# Altium project bms_R00.PrjPCB
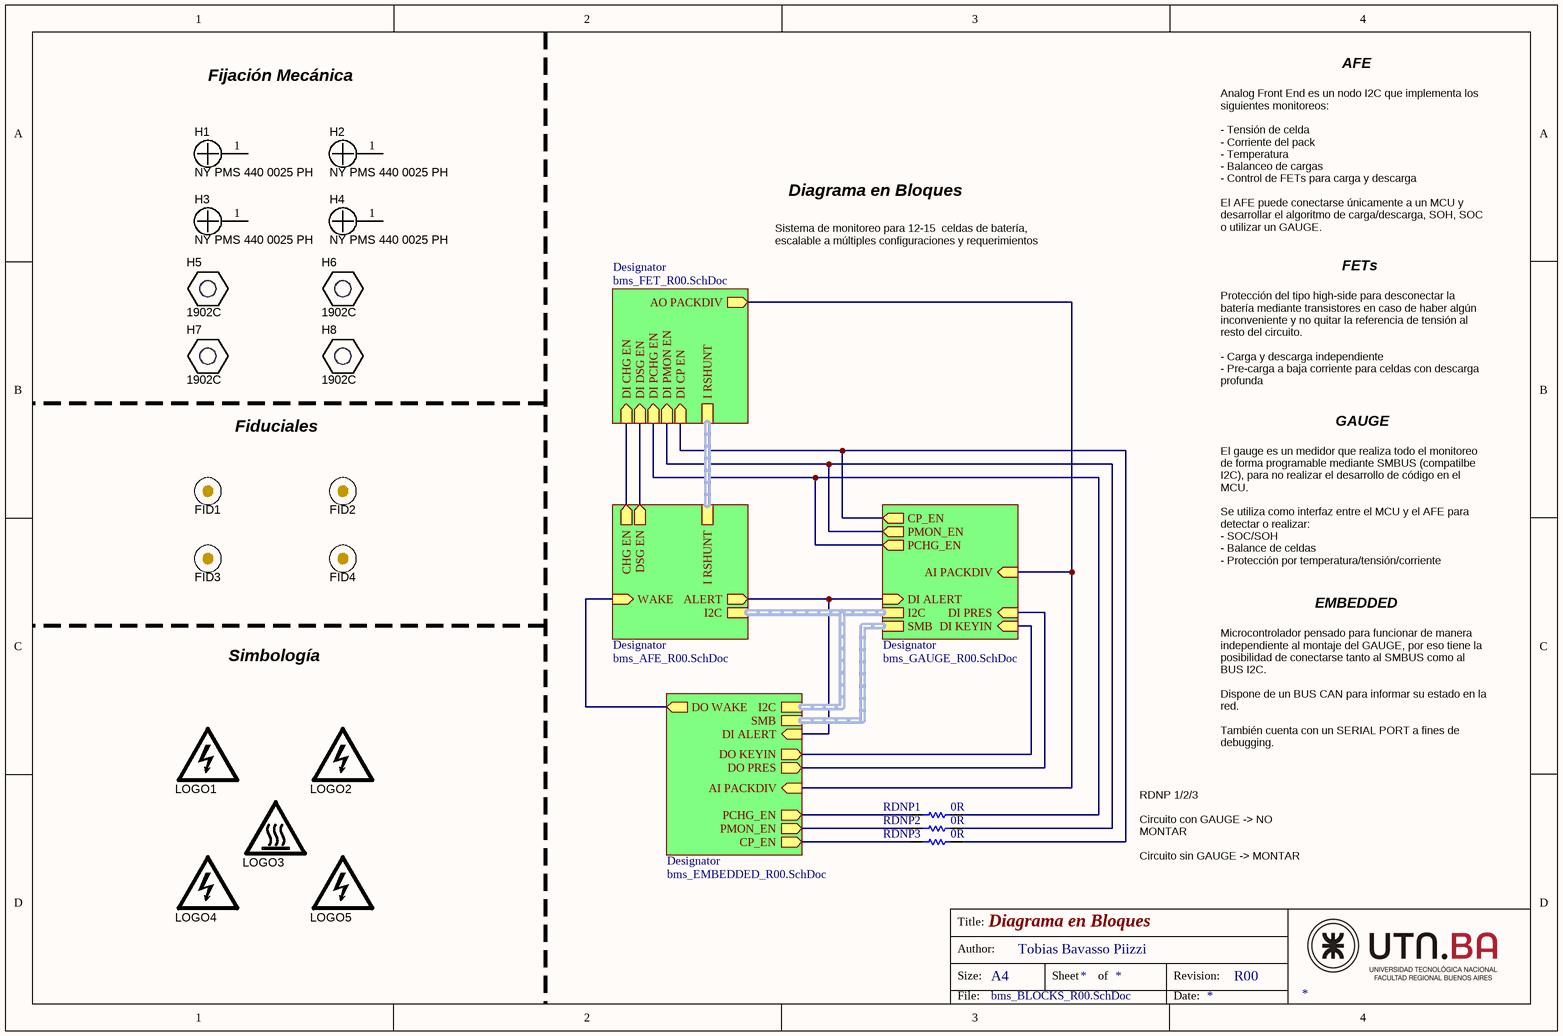
[diagram p0: bms_BLOCKS_R00.SchDoc]
5 sheets, 311 parts. Net scope: hierarchical (ports join the sheet entries above them; power ports are global).
Board files: bms_R00.PcbDoc, bmsPanel_R00.PcbDoc
Sheets:
  bms_BLOCKS_R00.SchDoc
    Designator = bms_FET_R00.SchDoc
    Designator = bms_AFE_R00.SchDoc
    Designator = bms_GAUGE_R00.SchDoc
    Designator = bms_EMBEDDED_R00.SchDoc

## Sheet bms_BLOCKS_R00.SchDoc: Diagrama en Bloques
size A4; Author: Tobias Bavasso Piizzi; Revision: R00

### Parts
FID1  Fiducial  [Fiducial10-20]  (value not drawn)
FID2  Fiducial  [Fiducial10-20]  (value not drawn)
FID3  Fiducial  [Fiducial10-20]  (value not drawn)
FID4  Fiducial  [Fiducial10-20]  (value not drawn)
H1  NY PMS 440 0025 PH  [NY PMS 440 0025 PH]
H2  NY PMS 440 0025 PH  [NY PMS 440 0025 PH]
H3  NY PMS 440 0025 PH  [NY PMS 440 0025 PH]
H4  NY PMS 440 0025 PH  [NY PMS 440 0025 PH]
H5  1902C  [Keystone_1902C]
H6  1902C  [Keystone_1902C]
H7  1902C  [Keystone_1902C]
H8  1902C  [Keystone_1902C]
LOGO1  DANGER HIGH VOLTAGE  [IEC_HighVoltage_Small]  (value not drawn)  (no BOM)
LOGO2  DANGER HIGH VOLTAGE  [IEC_HighVoltage_Small]  (value not drawn)  (no BOM)
LOGO3  CAUTION HOT SURFACE  [IEC_HotSurface_Small]  (value not drawn)  (no BOM)
LOGO4  DANGER HIGH VOLTAGE  [IEC_HighVoltage_Small]  (value not drawn)  (no BOM)
LOGO5  DANGER HIGH VOLTAGE  [IEC_HighVoltage_Small]  (value not drawn)  (no BOM)
RDNP1  0R  [R0603]
RDNP2  0R  [R0603]
RDNP3  0R  [R0603]

### Sub-sheets
Designator = bms_FET_R00.SchDoc: DI CHG EN (in), DI PMON EN (in), DI PCHG EN (in), I RSHUNT (harness I Sense), DI DSG EN (in), DI CP EN (in), AO PACKDIV (out)
Designator = bms_AFE_R00.SchDoc: I2C (harness I2C), CHG EN (out), DSG EN (out), ALERT (out), I RSHUNT (harness I Sense), WAKE (in)
Designator = bms_GAUGE_R00.SchDoc: PMON_EN (out), PCHG_EN (out), CP_EN (out), AI PACKDIV (in), DI ALERT (in), DI KEYIN (in), DI PRES (in), SMB (harness SMBus), I2C (harness I2C)
Designator = bms_EMBEDDED_R00.SchDoc: AI PACKDIV (in), DI ALERT (in), DO WAKE (out), PCHG_EN (out), I2C (harness I2C), SMB (harness SMBus), CP_EN (out), PMON_EN (out), DO PRES (out), DO KEYIN (out)

### Nets
~{KEY}: sheet Designator/DI KEYIN, sheet Designator/DO KEYIN
~{PRES}S: sheet Designator/DI PRES, sheet Designator/DO PRES
ALERT: sheet Designator/ALERT, sheet Designator/DI ALERT, sheet Designator/DI ALERT
CHG_EN: sheet Designator/DI CHG EN, sheet Designator/CHG EN
CP_EN: RDNP3.2 ; sheet Designator/DI CP EN, sheet Designator/CP_EN
DSG_EN: sheet Designator/DI DSG EN, sheet Designator/DSG EN
PACKDIV: sheet Designator/AO PACKDIV, sheet Designator/AI PACKDIV, sheet Designator/AI PACKDIV
PCHG_EN: RDNP1.2 ; sheet Designator/DI PCHG EN, sheet Designator/PCHG_EN
PMON_EN: RDNP2.2 ; sheet Designator/DI PMON EN, sheet Designator/PMON_EN
PTB4: RDNP3.1 ; sheet Designator/CP_EN
PTB5: RDNP2.1 ; sheet Designator/PMON_EN
PTC9: sheet Designator/WAKE, sheet Designator/DO WAKE
PTE8: RDNP1.1 ; sheet Designator/PCHG_EN

Not connected (* = marked no-connect by the designer): H1 1; H2 1; H3 1; H4 1

### Notes on the sheet
- Fijación Mecánica
- AFE
- Diagrama en Bloques
- Analog Front End es un nodo I2C que implementa los siguientes monitoreos:
  - Tensión de celda
  - Corriente del pack
  - Temperatura
  - Balanceo de cargas
  - Control de FETs para carga y descarga
  El AFE puede conectarse únicamente a un MCU y desarrollar el algoritmo de carga/descarga, SOH, SOC o utilizar un GAUGE.
- Sistema de monitoreo para 12-15  celdas de batería, escalable a múltiples configuraciones y requerimientos
- FETs
- Fiduciales
- Protección del tipo high-side para desconectar la batería mediante transistores en caso de haber algún inconveniente y no quitar la referencia de tensión al resto del circuito.
  - Carga y descarga independiente
  - Pre-carga a baja corriente para celdas con descarga profunda
- GAUGE
- El gauge es un medidor que realiza todo el monitoreo de forma programable mediante SMBUS (compatilbe I2C), para no realizar el desarrollo de código en el MCU.
  Se utiliza como interfaz entre el MCU y el AFE para detectar o realizar:
  - SOC/SOH
  - Balance de celdas
  - Protección por temperatura/tensión/corriente
- EMBEDDED
- Simbología
- Microcontrolador pensado para funcionar de manera independiente al montaje del GAUGE, por eso tiene la posibilidad de conectarse tanto al SMBUS como al BUS I2C.
  Dispone de un BUS CAN para informar su estado en la red.
  También cuenta con un SERIAL PORT a fines de debugging.
- RDNP 1/2/3
  Circuito con GAUGE -> NO MONTAR
  Circuito sin GAUGE -> MONTAR
- Title:
- Size:
- Author:
- A4
- Sheet
- of
- Revision:
- File:
- Date:

### Library data of the parts
FID1-FID4 = Fiducial_1: Fiducial mark.  There is nothing to buy or mount.; SymbolCreator: codlsc; SymbolVersion: 2009-11-4; CompType: Fiducial; Publisher: Texas Instruments; LatestRevisionDate: 2014-08-01; LatestRevisionNote: Added Alternate PartNumber and Alternate Manufacturer parameters to appropriate components.; Manufacturer: N/A; MountType: N/A; PackageReference: Fiducial; PartNumber: N/A; ClassName: FiducialMark
H1-H4 = NY PMS 440 0025 PH: Machine Screw, Round, #4-40 x 1/4, Nylon, Philips panhead; Manufacturer: B&F Fastener Supply; CompType: Hardware; SymbolCreator: codlsc; U/M: EA; SymbolVersion: 2009-10-28; MountType: N/A; RoHS: Y; PartNumber: NY PMS 440 0025 PH; PackageReference: Screw; DigiKeyPartNumber: H542-ND; ComponentLink1Description: Datasheet Link; ComponentLink1URL: http://www.fasnetdirect.com/refguide/Nylpanms.pdf; ClassName: Mounting Holes; LatestRevisionDate: 2015-07-23; Publisher: Texas Instruments; Supplier 1: Digi-Key; Supplier Part Number 1: H542-ND
H5-H8 = 1902C: Standoff, Hex, 0.5"L #4-40 Nylon; Manufacturer: Keystone; CompType: Hardware; MountType: N/A; RoHS: Y; PartNumber: 1902C; PackageReference: Standoff; ComponentLink1Description: Datasheet Link; ComponentLink1URL: http://www.keyelco.com/pdfs/M55-prod31.pdf; Alternate Manufacturer: -; Alternate PartNumber: -; LatestRevisionDate: 2012-06-27; LatestRevisionNote: Initial Version; Publisher: Texas Instruments; Supplier 1: Digi-Key; Supplier Part Number 1: 1902CK-ND
LOGO1 LOGO2 LOGO4 LOGO5 = IEC_HighVoltage: IEC 61010-1 High Voltage Warning; SymbolCreator: a0412235; SymbolVersion: 2011-08-22; Published: 2009-03-03; Publisher: Texas Instruments; LatestRevisionDate: 2016-03-21
LOGO3 = IEC_HotSurface: IEC 61010-1 Hot Surface Warning; SymbolCreator: a0412235; SymbolVersion: 2011-08-22; Published: 2009-03-03; Publisher: Texas Instruments; LatestRevisionDate: 2016-03-21
RDNP1-RDNP3 = Res: Resistor

## Sheet bms_FET_R00.SchDoc: **
size A4; Author: **; CompanyName: Introducción al Diseño de Circuitos Impresos; Organization: UTN FRBA; Revision: **
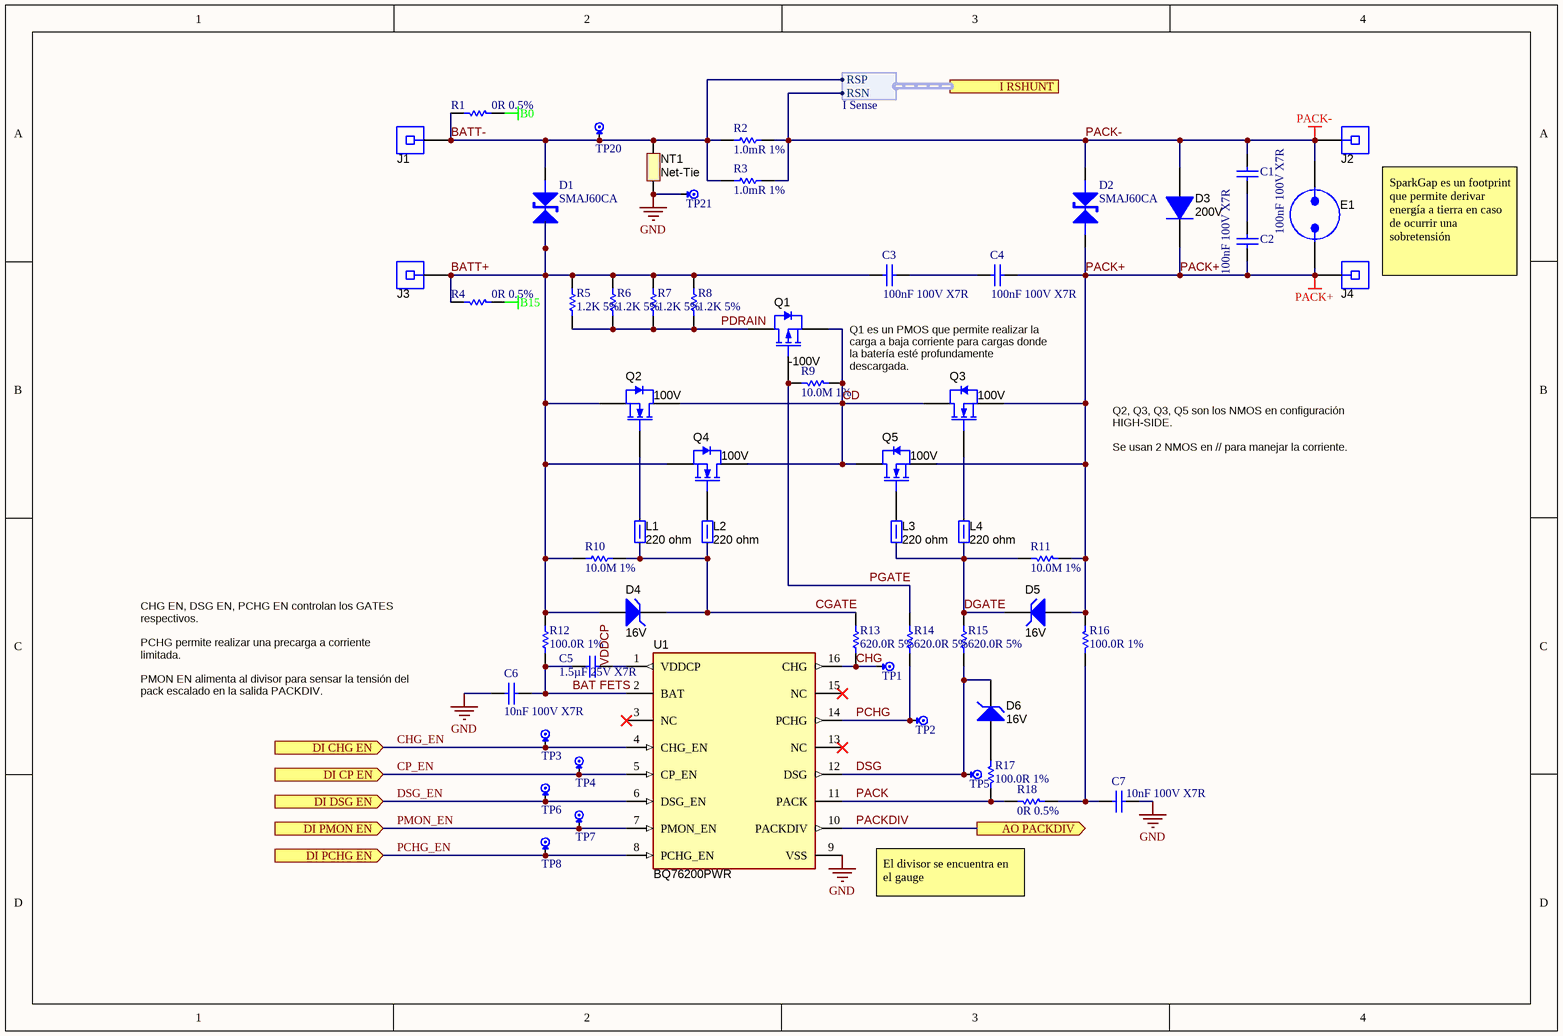
[diagram p1: bms_FET_R00.SchDoc]

### Parts
C1  100nF 100V X7R  [C0603]
C2  100nF 100V X7R  [C0603]
C3  100nF 100V X7R  [C0603]
C4  100nF 100V X7R  [C0603]
C5  1.5µF 25V X7R  [0805_HV_2]
C6  10nF 100V X7R  [0805_HV_2]
C7  10nF 100V X7R  [0805_HV_2]
D1  SMAJ60CA  [DO-214AB(SMA)]
D2  SMAJ60CA  [DO-214AB(SMA)]
D3  value 200V  [SMC]  (hidden comment: ES3D-E3/57T)
D4  value 16V  [sod-323]  (hidden comment: MMSZ5246BS-7-F)
D5  value 16V  [sod-323]  (hidden comment: MMSZ5246BS-7-F)
D6  value 16V  [sod-323]  (hidden comment: MMSZ5246BS-7-F)
E1  N/A  [SPARK_GAP2]  (value not drawn)
J1  L35  [TB_L35]  (value not drawn)
J2  L35  [TB_L35]  (value not drawn)
J3  L35  [TB_L35]  (value not drawn)
J4  L35  [TB_L35]  (value not drawn)
L1  value 220 ohm  [0603 FB]  (hidden comment: BLM18SG221TN1D)
L2  value 220 ohm  [0603 FB]  (hidden comment: BLM18SG221TN1D)
L3  value 220 ohm  [0603 FB]  (hidden comment: BLM18SG221TN1D)
L4  value 220 ohm  [0603 FB]  (hidden comment: BLM18SG221TN1D)
NT1  Net-Tie  [Net-Tie_50milWide_30milLong]  (net tie, no BOM)
Q1  value -100V  [SOT-23]  (hidden comment: ZXMP10A13FTA)
Q2  value 100V  [KTT0002A_N]  (hidden comment: CSD19536KTT)
Q3  value 100V  [KTT0002A_N]  (hidden comment: CSD19536KTT)
Q4  value 100V  [KTT0002A_N]  (hidden comment: CSD19536KTT)
Q5  value 100V  [KTT0002A_N]  (hidden comment: CSD19536KTT)
R1  0R 0.5%  [R0603]
R2  1.0mR 1%  [2010]
R3  1.0mR 1%  [2010]
R4  0R 0.5%  [R0603]
R5  1.2K 5%  [2512]
R6  1.2K 5%  [2512]
R7  1.2K 5%  [2512]
R8  1.2K 5%  [2512]
R9  10.0M 1%  [R0603]
R10  10.0M 1%  [R0603]
R11  10.0M 1%  [R0603]
R12  100.0R 1%  [R0603]
R13  620.0R 5%  [R0603]
R14  620.0R 5%  [R0603]
R15  620.0R 5%  [R0603]
R16  100.0R 1%  [R0603]
R17  100.0R 1%  [R0603]
R18  0R 0.5%  [R0603]
TP1  Test Point  [TEST POINT SMD 1]  (value not drawn)
TP2  Test Point  [TEST POINT SMD 1]  (value not drawn)
TP3  Test Point  [TEST POINT SMD 1]  (value not drawn)
TP4  Test Point  [TEST POINT SMD 1]  (value not drawn)
TP5  Test Point  [TEST POINT SMD 1]  (value not drawn)
TP6  Test Point  [TEST POINT SMD 1]  (value not drawn)
TP7  Test Point  [TEST POINT SMD 1]  (value not drawn)
TP8  Test Point  [TEST POINT SMD 1]  (value not drawn)
TP20  Test Point  [TEST POINT SMD 1]  (value not drawn)
TP21  Test Point  [TEST POINT SMD 1]  (value not drawn)
U1  BQ76200PWR  [PW0016A_N]

### Ports
AO PACKDIV (out), DI CHG EN (in), DI CP EN (in), DI DSG EN (in), DI PCHG EN (in), DI PMON EN (in), I RSHUNT (harness I Sense)

### Harnesses
I Sense: RSP, RSN

### Nets
B0: R1.2
B15: R4.2
GND: C6.1 C7.2 NT1.1 TP21.1 U1.9(VSS)
PACK+: C2.1 C4.2 D2.K D3.1(K) D5.2(A) E1.1 J4.1 Q3.3(S) Q5.3(S) R11.2 R16.2
PACK-: C1.2 D2.A D3.2(A) E1.2 J2.1 R2.2 R3.2 ; port I RSHUNT.RSN
BAT FETS: C5.1 C6.2 R12.1 U1.2(BAT)
BATT+: C3.1 D1.K D4.2(A) J3.1 Q2.3(S) Q4.3(S) R4.1 R5.2 R6.2 R7.2 R8.2 R10.2 R12.2
BATT-: D1.A J1.1 NT1.2 R1.1 R2.1 R3.1 TP20.1 ; port I RSHUNT.RSP
CD: Q1.2(S) Q2.2(D) Q3.2(D) Q4.2(D) Q5.2(D) R9.2
CGATE: D4.1(K) L1.1 L2.1 R10.1 R13.1
CHG: R13.2 TP1.1 U1.16(CHG)
CHG_EN: TP3.1 U1.4(CHG_EN) ; port DI CHG EN
CP_EN: TP4.1 U1.5(CP_EN) ; port DI CP EN
DGATE: D5.1(K) L3.1 L4.1 R11.1 R15.1
DSG: D6.1(K) R15.2 TP5.1 U1.12(DSG)
DSG_EN: TP6.1 U1.6(DSG_EN) ; port DI DSG EN
PACK: R17.1 R18.2 U1.11(PACK)
PACKDIV: U1.10(PACKDIV) ; port AO PACKDIV
PCHG: R14.2 TP2.1 U1.14(PCHG)
PCHG_EN: TP8.1 U1.8(PCHG_EN) ; port DI PCHG EN
PDRAIN: Q1.3(D) R5.1 R6.1 R7.1 R8.1
PGATE: Q1.1(G) R9.1 R14.1
PMON_EN: TP7.1 U1.7(PMON_EN) ; port DI PMON EN
VDDCP: C5.2 U1.1(VDDCP)
NetC1_1: C1.1 C2.2
NetC3_2: C3.2 C4.1
NetC7_1: C7.1 R16.1 R18.1
NetD6_2: D6.2(A) R17.2
NetL1_2: L1.2 Q2.1(G)
NetL2_2: L2.2 Q4.1(G)
NetL3_2: L3.2 Q5.1(G)
NetL4_2: L4.2 Q3.1(G)

Not connected (* = marked no-connect by the designer): U1 3(NC)* 13(NC)* 15(NC)*

### Notes on the sheet
- SparkGap es un footprint que permite derivar energía a tierra en caso de ocurrir una sobretensión
- Q1 es un PMOS que permite realizar la carga a baja corriente para cargas donde la batería esté profundamente descargada.
- Q2, Q3, Q3, Q5 son los NMOS en configuración HIGH-SIDE.
  Se usan 2 NMOS en // para manejar la corriente.
- CHG EN, DSG EN, PCHG EN controlan los GATES respectivos.
  PCHG permite realizar una precarga a corriente limitada.
  PMON EN alimenta al divisor para sensar la tensión del pack escalado en la salida PACKDIV.
- El divisor se encuentra en el gauge

### Library data of the parts
C1-C4 = Cap 0603: Capacitor
C5-C7 = Cap 0805_HV: Capacitor
D1 D2 = SMAJ60CA: TVS DIODE 22VWM 35.5VC DO214AC. / BIDIRECCIONAL
D3 = ES3D-E3/57T: Diode, Ultrafast, 200V, 3A, SMC; Manufacturer: Vishay-Semiconductor; U/M: EA; Vf_V: 0.9; Value2: 0.9V; Io_A: 3; Vr_V: 200; TJmax_C: 150; SymbolVersion: 2008-12-08; PartNumber: ES3D-E3/57T; PackageReference: SMC; CompType: Diode; Value1: 3A; MountType: SMT; Type: Ultrafast; RoHS: Y; Published: 2008-06-26; Publisher: Texas Instruments; LatestRevisionDate: 2014-01-31; ComponentLink1Description: Datasheet link; ComponentLink1URL: http://www.vishay.com/docs/88589/88589.pdf; Supplier 1: Digi-Key; Supplier Part Number 1: ES3D-E3/57TGICT-ND; Supplier 2: Mouser; Supplier Part Number 2: 625-ES3D-E3; Supplier 3: Farnell; Supplier Part Number 3: 1021753
D4-D6 = MMSZ5246BS-7-F: Diode, Zener, 16 V, 200 mW, SOD-323; Manufacturer: Diodes Inc.; SymbolCreator: a0412235; U/M: EA; Power_W: 0.2; Vz_V: 16; Value1: 0.2W; RJA_CperW: 350; AEC Category: Q101; SymbolVersion: 2010-08-25; PartNumber: MMSZ5246BS-7-F; PackageReference: SOD-323; CompType: Zener; Vr_V: N/A; MountType: SMT; RoHS: Y; ComponentLink1Description: Datasheet link; ComponentLink1URL: http://www.diodes.com/datasheets/ds31038.pdf; Published: 2008-10-08; Publisher: Texas Instruments; LatestRevisionDate: 2016-02-26; LatestRevisionNote: Updated Supplier Data; Supplier 1: Digi-Key; Supplier Part Number 1: MMSZ5246BS-FDICT-ND; Supplier 2: Mouser; Supplier Part Number 2: 621-MMSZ5246BS-7-F; AEC Qualified: ?
E1 = SparkGap: Spark Gap; SymbolCreator: a0412235; SymbolVersion: 2013-07-11; Manufacturer: N/A; PartNumber: N/A; MountType: N/A; CompType: Spark Gap; Publisher: Texas Instruments; LatestRevisionDate: 2013-12-05; LatestRevisionNote: Added Alternate PartNumber and Alternate Manufacturer parameters to appropriate components.; Alternate Manufacturer: -; Alternate PartNumber: -
J1-J4 = L35: Connector, L Type Copper Single Conductor, TH; Manufacturer: Thomas & Betts; SymbolCreator: a0799628; Gender: Female; Row_Count: 1; SymbolVersion: 2014-1-06; PartNumber: L35; PackageReference: Connector, L Type Copper Single Conductor, TH; CompType: Connector; RoHS: N; MountType: TH; ComponentLink1Description: Datasheet URL; ComponentLink1URL: http://www.tnb.com/ps/fulltilt/index.cgi?check=Y&part=L35; Orientation: Vertical; PinCount: 1; ContactFinish: Copper; Publisher: Texas Instruments; LatestRevisionDate: 2016-07-21
L1-L4 = BLM18SG221TN1D: Ferrite Bead, 220 ohm @ 100 MHz, 2.5 A, 0603; Manufacturer: MuRata; Imax_A: 2.5; DCR_ohm: 0.04; Value1: 0.04 ohm; Value2: 2.5A; ZTyp@100MHz_Ohm: 220; CompType: Ferrite Bead; SymbolVersion: 2009-06-02; PartNumber: BLM18SG221TN1D; MountType: SMT; PackageReference: 0603; Published: 2014-04-30; Publisher: Texas Instruments; LatestRevisionDate: 2015-05-26; ComponentLink1Description: Datasheet link; ComponentLink1URL: http://search.murata.co.jp/Ceramy/image/img/PDF/ENG/L0110S0100BLM18S.pdf; RoHS: Y; Supplier 1: Digi-Key; Supplier Part Number 1: 490-5225-1-ND; Supplier 2: Mouser; Supplier Part Number 2: 81-BLM18SG221TN1D; Supplier 3: Farnell; Supplier Part Number 3: 1515753
NT1 = Net-Tie: Single point connection between nets.; SymbolCreator: codlsc; SymbolVersion: 2009-07-01; MountType: SMT; PackageReference: N/A; Publisher: Texas Instruments; LatestRevisionDate: 2015-10-18; LatestRevisionNote: Added Alternate PartNumber and Alternate Manufacturer parameters to appropriate components.
Q1 = ZXMP10A13FTA: MOSFET, P-CH, -100V, -0.6A, SOT-23; Manufacturer: Diodes Inc.; Alternate Manufacturer: None; U/M: EA; ChType: P; VdsMax_V: -100; Value1: 1 ohm; Rdson45_Ohm: 1; Value2: 3.5 nC; QgTyp_nC: 3.5; Vgs_V: -4; IdsMax_A: -0.6; SymbolVersion: 2008-07-09; PartNumber: ZXMP10A13FTA; PackageReference: SOT-23; CompType: MOSFET; RoHS: Y; MountType: SMT; Published: 2008-06-19; Publisher: Texas Instruments; LatestRevisionDate: 2013-12-01; LatestRevisionNote: Added parts.; ComponentLink1Description: Datasheet link; ComponentLink1URL: http://www.diodes.com/datasheets/ZXMP10A13F.pdf; Supplier 1: Digi-Key; Supplier Part Number 1: ZXMP10A13FCT-ND; Supplier 2: Mouser; Supplier Part Number 2: 522-ZXMP10A13FTA; Supplier 3: Farnell; Supplier Part Number 3: 1843777
Q2-Q5 = CSD19536KTT: MOSFET, N-CH, 100 V, 200 A, KTT0002A; Manufacturer: Texas Instruments; Alternate Manufacturer: None; U/M: EA; ChType: N; VdsMax_V: 100; Value1: ? ohm; Value2: 118 nC; QgTyp_nC: 118; Vgs_V: 20; IdsMax_A: 200; AEC Category: Q101; SymbolVersion: 2008-07-28; PartNumber: CSD19536KTT; PackageReference: KTT0002A; CompType: MOSFET; RoHS: Y; MountType: SMT; Published: 2008-06-19; Publisher: Texas Instruments; LatestRevisionDate: 2016-02-08; LatestRevisionNote: Added parts.; ComponentLink1Description: Datasheet link; ComponentLink1URL: http://www.ti.com/lit/ds/symlink/csd19536ktt.pdf; Supplier 1: Digi-Key; Supplier Part Number 1: 296-41136-1-ND; Supplier 2: Mouser; Supplier Part Number 2: 595-CSD19536KTT; AEC Qualified: ?
R1-R18 = Res: Resistor
U1 = BQ76200PWR: bq76200: Low-Power, High-Side N-channel FET Driver with Pack Voltage Monitor, PW0016A; Manufacturer: Texas Instruments; SymbolCreator: x0208325; SizeArea_mm2: 32; SizeAreaWB_mm2: 58.8; SizeX_mm: 6.4; SizeY_mm: 5; SizeZ_mm: 1.2; CompType: IC; U/M: EA; SymbolVersion: 2013-12-26; PartNumber: BQ76200PWR; Alternate PartNumber: BQ76200PW; PackageReference: PW0016A; PackageDescription: TSSOP-16; MountType: SMT; ComponentLink1Description: Datasheet Link; ComponentLink1URL: http://www.ti.com/lit/ds/symlink/bq76200.pdf; RoHS: Y; Publisher: Texas Instruments; LatestRevisionDate: 2016-06-17; Alternate Manufacturer: Texas Instruments

## Sheet bms_AFE_R00.SchDoc
size A1
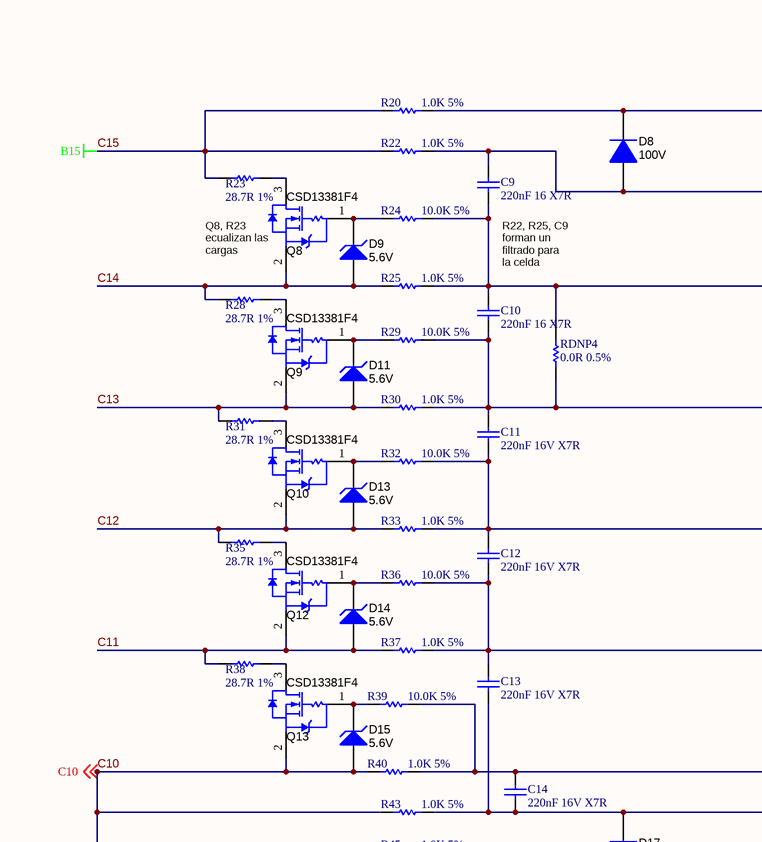
[diagram p2: bms_AFE_R00.SchDoc, top left]
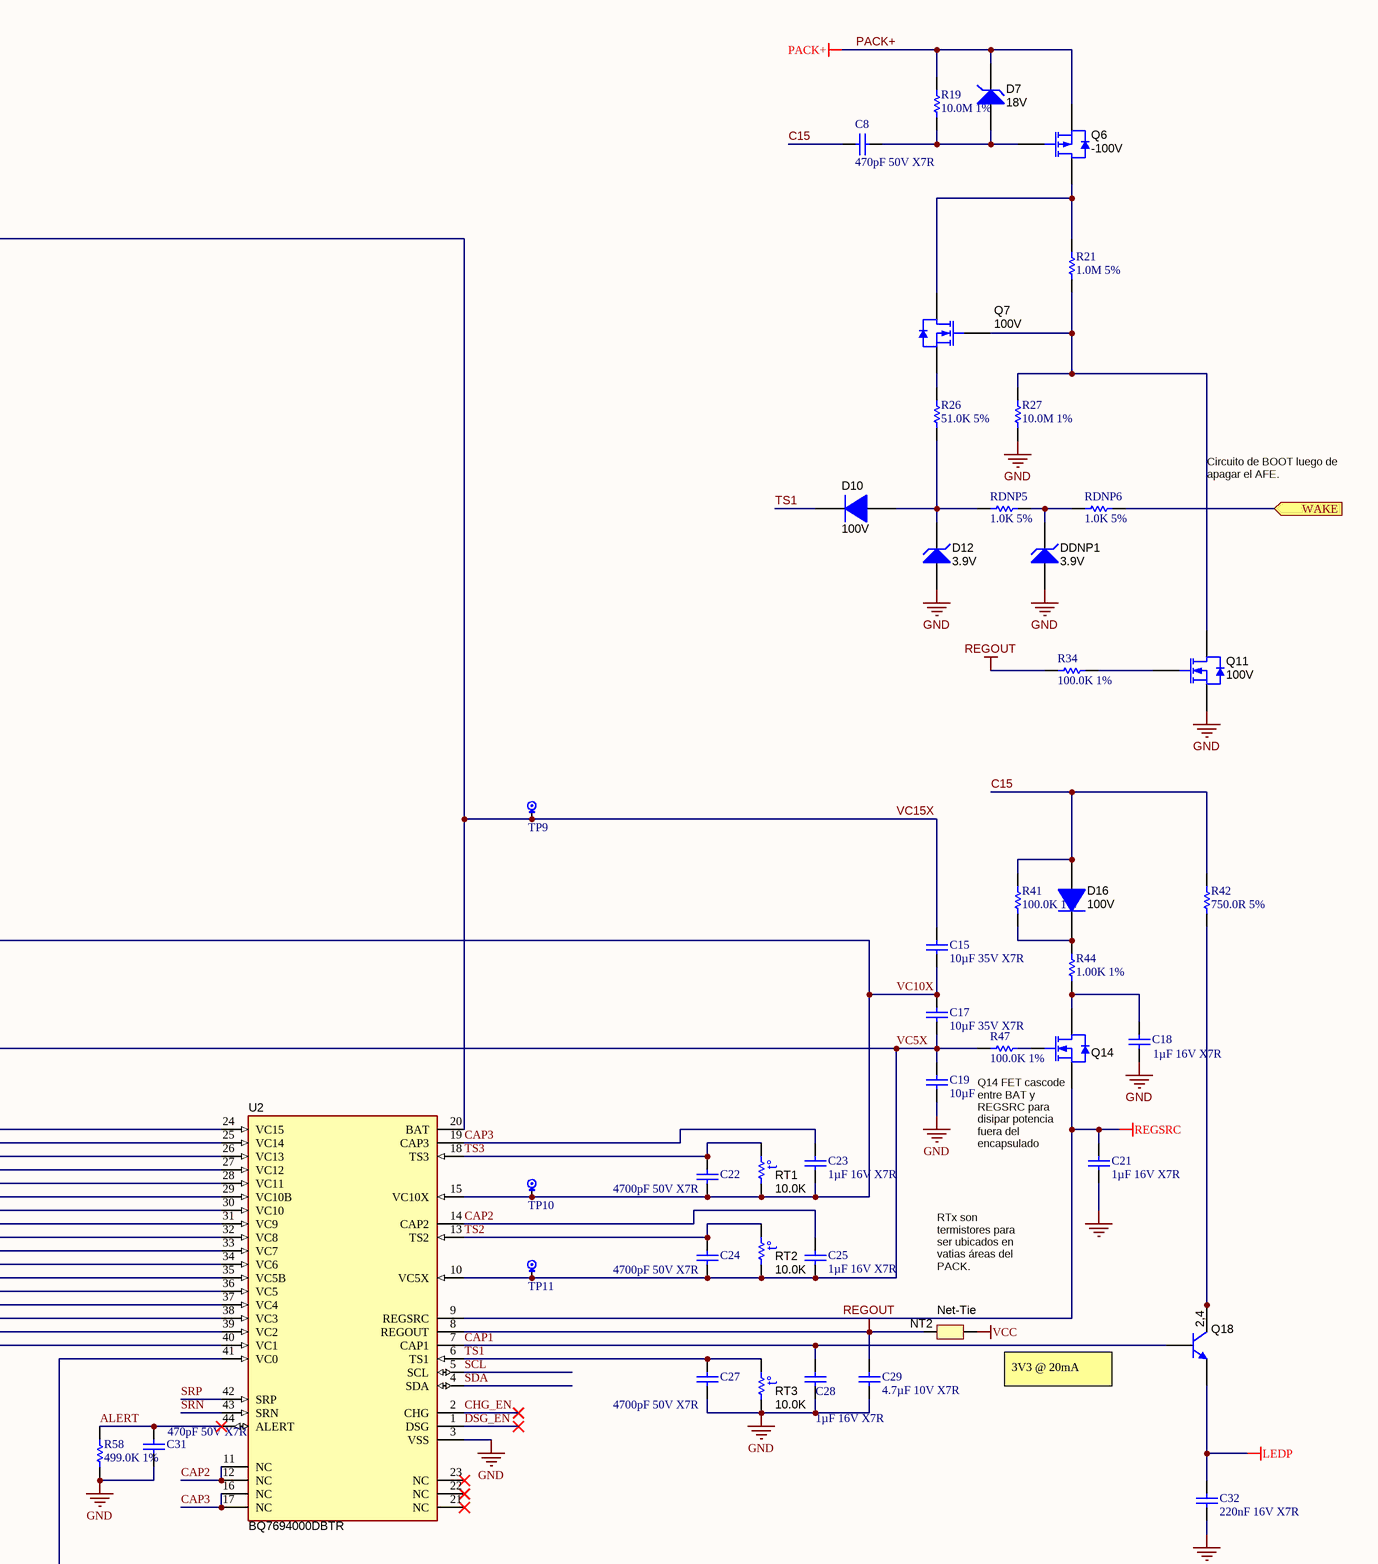
[diagram p3: bms_AFE_R00.SchDoc, top right]
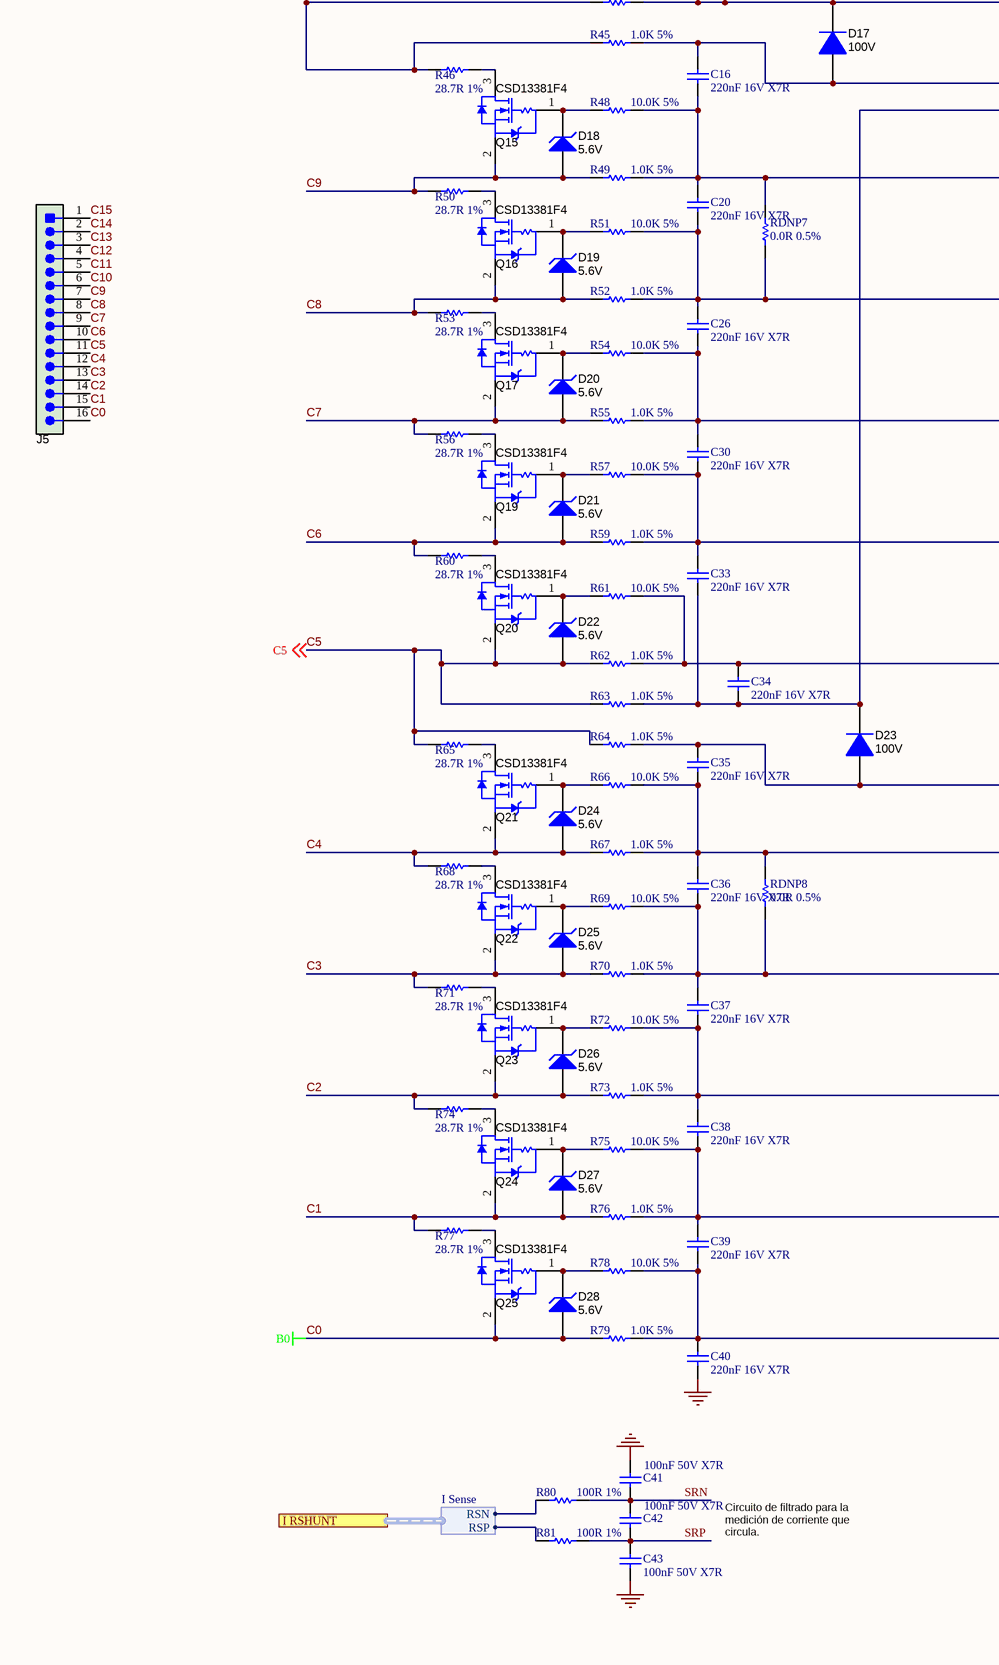
[diagram p4: bms_AFE_R00.SchDoc, bottom left]
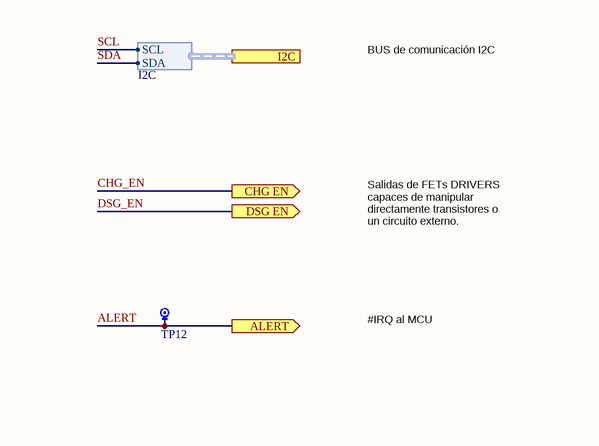
[diagram p5: bms_AFE_R00.SchDoc, bottom right]

### Parts
C8  470pF 50V X7R  [C0603]
C9  220nF 16 X7R  [C0603]
C10  220nF 16 X7R  [C0603]
C11  220nF 16V X7R  [C0603]
C12  220nF 16V X7R  [C0603]
C13  220nF 16V X7R  [C0603]
C14  220nF 16V X7R  [C0603]
C15  10µF 35V X7R  [1210_270]
C16  220nF 16V X7R  [C0603]
C17  10µF 35V X7R  [1210_270]
C18  1µF 16V X7R  [0805_HV_2]
C19  10µF  [1210_270]
C20  220nF 16V X7R  [C0603]
C21  1µF 16V X7R  [0805]
C22  4700pF 50V X7R  [C0603]
C23  1µF 16V X7R  [C0603]
C24  4700pF 50V X7R  [C0603]
C25  1µF 16V X7R  [C0603]
C26  220nF 16V X7R  [C0603]
C27  4700pF 50V X7R  [C0603]
C28  1µF 16V X7R  [C0603]
C29  4.7µF 10V X7R  [0805_HV_2]
C30  220nF 16V X7R  [C0603]
C31  470pF 50V X7R  [C0603]
C32  220nF 16V X7R  [C0603]
C33  220nF 16V X7R  [C0603]
C34  220nF 16V X7R  [C0603]
C35  220nF 16V X7R  [C0603]
C36  220nF 16V X7R  [C0603]
C37  220nF 16V X7R  [C0603]
C38  220nF 16V X7R  [C0603]
C39  220nF 16V X7R  [C0603]
C40  220nF 16V X7R  [C0603]
C41  100nF 50V X7R  [C0603]
C42  100nF 50V X7R  [C0603]
C43  100nF 50V X7R  [C0603]
D7  value 18V  [sod-323]  (hidden comment: MMSZ5248BS-7-F)
D8  value 100V  [SOD-123]  (hidden comment: 1N4148W-7-F)
D9  value 5.6V  [sod-323]  (hidden comment: MMSZ5232BS-7-F)
D10  value 100V  [SOD-123]  (hidden comment: 1N4148W-7-F)
D11  value 5.6V  [sod-323]  (hidden comment: MMSZ5232BS-7-F)
D12  value 3.9V  [sod-323]  (hidden comment: MMSZ5228BS-7-F)
D13  value 5.6V  [sod-323]  (hidden comment: MMSZ5232BS-7-F)
D14  value 5.6V  [sod-323]  (hidden comment: MMSZ5232BS-7-F)
D15  value 5.6V  [sod-323]  (hidden comment: MMSZ5232BS-7-F)
D16  value 100V  [SOD-123]  (hidden comment: 1N4148W-7-F)
D17  value 100V  [SOD-123]  (hidden comment: 1N4148W-7-F)
D18  value 5.6V  [sod-323]  (hidden comment: MMSZ5232BS-7-F)
D19  value 5.6V  [sod-323]  (hidden comment: MMSZ5232BS-7-F)
D20  value 5.6V  [sod-323]  (hidden comment: MMSZ5232BS-7-F)
D21  value 5.6V  [sod-323]  (hidden comment: MMSZ5232BS-7-F)
D22  value 5.6V  [sod-323]  (hidden comment: MMSZ5232BS-7-F)
D23  value 100V  [SOD-123]  (hidden comment: 1N4148W-7-F)
D24  value 5.6V  [sod-323]  (hidden comment: MMSZ5232BS-7-F)
D25  value 5.6V  [sod-323]  (hidden comment: MMSZ5232BS-7-F)
D26  value 5.6V  [sod-323]  (hidden comment: MMSZ5232BS-7-F)
D27  value 5.6V  [sod-323]  (hidden comment: MMSZ5232BS-7-F)
D28  value 5.6V  [sod-323]  (hidden comment: MMSZ5232BS-7-F)
DDNP1  value 3.9V  [sod-323]  (hidden comment: MMSZ5228BS-7-F)
J5  395021011  [HEADER_395021016]  (value not drawn)
NT2  Net-Tie  [Net-Tie_50milWide_30milLong]  (net tie, no BOM)
Q6  value -100V  [SOT-23]  (hidden comment: ZXMP10A13FTA)
Q7  value 100V  [SOT-23]  (hidden comment: BSS123)
Q8  CSD13381F4  [YJC0003A]
Q9  CSD13381F4  [YJC0003A]
Q10  CSD13381F4  [YJC0003A]
Q11  value 100V  [SOT-23]  (hidden comment: BSS123)
Q12  CSD13381F4  [YJC0003A]
Q13  CSD13381F4  [YJC0003A]
Q14  BST82,215  [SOT-23]  (value not drawn)
Q15  CSD13381F4  [YJC0003A]
Q16  CSD13381F4  [YJC0003A]
Q17  CSD13381F4  [YJC0003A]
Q18  ZXTN19100CZTA  [SOT-89-3]  (value not drawn)
Q19  CSD13381F4  [YJC0003A]
Q20  CSD13381F4  [YJC0003A]
Q21  CSD13381F4  [YJC0003A]
Q22  CSD13381F4  [YJC0003A]
Q23  CSD13381F4  [YJC0003A]
Q24  CSD13381F4  [YJC0003A]
Q25  CSD13381F4  [YJC0003A]
R19  10.0M 1%  [R0603]
R20  1.0K 5%  [R0603]
R21  1.0M 5%  [R0603]
R22  1.0K 5%  [R0603]
R23  28.7R 1%  [2512]
R24  10.0K 5%  [R0603]
R25  1.0K 5%  [R0603]
R26  51.0K 5%  [R0603]
R27  10.0M 1%  [R0603]
R28  28.7R 1%  [2512]
R29  10.0K 5%  [R0603]
R30  1.0K 5%  [R0603]
R31  28.7R 1%  [2512]
R32  10.0K 5%  [R0603]
R33  1.0K 5%  [R0603]
R34  100.0K 1%  [0805_HV_2]
R35  28.7R 1%  [2512]
R36  10.0K 5%  [R0603]
R37  1.0K 5%  [R0603]
R38  28.7R 1%  [2512]
R39  10.0K 5%  [R0603]
R40  1.0K 5%  [R0603]
R41  100.0K 1%  [0805_HV_2]
R42  750.0R 5%  [2010]
R43  1.0K 5%  [R0603]
R44  1.00K 1%  [2010]
R45  1.0K 5%  [R0603]
R46  28.7R 1%  [2512]
R47  100.0K 1%  [0805_HV_2]
R48  10.0K 5%  [R0603]
R49  1.0K 5%  [R0603]
R50  28.7R 1%  [2512]
R51  10.0K 5%  [R0603]
R52  1.0K 5%  [R0603]
R53  28.7R 1%  [2512]
R54  10.0K 5%  [R0603]
R55  1.0K 5%  [R0603]
R56  28.7R 1%  [2512]
R57  10.0K 5%  [R0603]
R58  499.0K 1%  [R0603]
R59  1.0K 5%  [R0603]
R60  28.7R 1%  [2512]
R61  10.0K 5%  [R0603]
R62  1.0K 5%  [R0603]
R63  1.0K 5%  [R0603]
R64  1.0K 5%  [R0603]
R65  28.7R 1%  [2512]
R66  10.0K 5%  [R0603]
R67  1.0K 5%  [R0603]
R68  28.7R 1%  [2512]
R69  10.0K 5%  [R0603]
R70  1.0K 5%  [R0603]
R71  28.7R 1%  [2512]
R72  10.0K 5%  [R0603]
R73  1.0K 5%  [R0603]
R74  28.7R 1%  [2512]
R75  10.0K 5%  [R0603]
R76  1.0K 5%  [R0603]
R77  28.7R 1%  [2512]
R78  10.0K 5%  [R0603]
R79  1.0K 5%  [R0603]
R80  100R 1%  [0805_HV_2]
R81  100R 1%  [0805_HV_2]
RDNP4  0.0R 0.5%  [R0603]
RDNP5  1.0K 5%  [R0603]
RDNP6  1.0K 5%  [R0603]
RDNP7  0.0R 0.5%  [R0603]
RDNP8  0.0R 0.5%  [R0603]
RT1  value 10.0K  [Thermistor_103AT-2]  (hidden comment: 103AT-2)
RT2  value 10.0K  [Thermistor_103AT-2]  (hidden comment: 103AT-2)
RT3  value 10.0K  [Thermistor_103AT-2]  (hidden comment: 103AT-2)
TP9  Test Point  [TEST POINT SMD 1]  (value not drawn)
TP10  Test Point  [TEST POINT SMD 1]  (value not drawn)
TP11  Test Point  [TEST POINT SMD 1]  (value not drawn)
TP12  Test Point  [TEST POINT SMD 1]  (value not drawn)
U2  BQ7694000DBTR  [DBT0044A_N]

### Ports
ALERT (out), CHG EN (out), DSG EN (out), I2C (harness I2C), I RSHUNT (harness I Sense), WAKE (in)

### Harnesses
I2C: SCL, SDA
I Sense: RSP, RSN

### Nets
B0: D28.2(A) J5.16 Q25.2(S) R79.1  [also labelled C0]
B15: C8.2 D16.2(A) J5.1 R20.1 R22.1 R23.2 R41.2 R42.2  [also labelled C15]
GND: C18.1 C19.1 C21.1 C27.1 C28.1 C29.1 C31.1 C32.1 C40.1 C41.2 C43.1 D12.2(A) DDNP1.2(A) Q11.2(S) R27.1 R58.1 RT3.1 U2.3(VSS)
LEDP: C32.2 Q18.3(E)
PACK+: D7.1(K) Q6.2(S) R19.2
PACK-: R80.1 ; port I RSHUNT.RSN
REGOUT: C29.2 NT2.1 R34.2 U2.8(REGOUT)
REGSRC: C21.2 Q14.2(S) U2.9(REGSRC)
VCC: NT2.2
ALERT: C31.2 R58.2 TP12.1 U2.44(ALERT) ; port ALERT
BATT-: R81.1 ; port I RSHUNT.RSP
C1: D27.2(A) J5.15 Q24.2(S) R76.1 R77.2
C2: D26.2(A) J5.14 Q23.2(S) R73.1 R74.2
C3: D25.2(A) J5.13 Q22.2(S) R70.1 R71.2
C4: D24.2(A) J5.12 Q21.2(S) R67.1 R68.2
C5: D22.2(A) J5.11 Q20.2(S) R62.1 R63.1 R64.1 R65.2 ; off-sheet C5
C6: D21.2(A) J5.10 Q19.2(S) R59.1 R60.2
C7: D20.2(A) J5.9 Q17.2(S) R55.1 R56.2
C8: D19.2(A) J5.8 Q16.2(S) R52.1 R53.2
C9: D18.2(A) J5.7 Q15.2(S) R49.1 R50.2
C10: D15.2(A) J5.6 Q13.2(S) R40.1 R43.1 R45.1 R46.2 ; off-sheet C10
C11: D14.2(A) J5.5 Q12.2(S) R37.1 R38.2
C12: D13.2(A) J5.4 Q10.2(S) R33.1 R35.2
C13: D11.2(A) J5.3 Q9.2(S) R30.1 R31.2
C14: D9.2(A) J5.2 Q8.2(S) R25.1 R28.2
CAP1: C28.2 Q18.1(B) U2.7(CAP1)
CAP2: C25.2 U2.11(NC) U2.12(NC) U2.14(CAP2)
CAP3: C23.2 U2.16(NC) U2.17(NC) U2.19(CAP3)
CHG_EN: U2.2(CHG) ; port CHG EN
DSG_EN: U2.1(DSG) ; port DSG EN
PTC9: RDNP6.1 ; port WAKE
SCL: U2.5(SCL) ; port I2C.SCL
SDA: U2.4(SDA) ; port I2C.SDA
SRN: C41.1 C42.2 R80.2 U2.43(SRN)
SRP: C42.1 C43.2 R81.2 U2.42(SRP)
TS1: C27.2 D10.1(K) RT3.2 U2.6(TS1)
TS2: C24.2 RT2.2 U2.13(TS2)
TS3: C22.2 RT1.2 U2.18(TS3)
VC5X: C17.1 C19.2 C24.1 C25.1 C33.1 C34.1 D23.1(K) R47.1 R63.2 RT2.1 TP11.1 U2.10(VC5X)
VC10X: C13.1 C14.1 C15.1 C17.2 C22.1 C23.1 D17.1(K) R43.2 RT1.1 TP10.1 U2.15(VC10X)
VC15X: C15.2 D8.1(K) R20.2 TP9.1 U2.20(BAT)
NetC8_1: C8.1 D7.2(A) Q6.1(G) R19.1
NetC9_1: C9.1 C10.2 R24.2 R25.2 RDNP4.2 U2.25(VC14)
NetC9_2: C9.2 D8.2(A) R22.2 U2.24(VC15)
NetC10_1: C10.1 C11.2 R29.2 R30.2 RDNP4.1 U2.26(VC13)
NetC11_1: C11.1 C12.2 R32.2 R33.2 U2.27(VC12)
NetC12_1: C12.1 C13.2 R36.2 R37.2 U2.28(VC11)
NetC14_2: C14.2 R39.2 R40.2 U2.29(VC10B)
NetC16_1: C16.1 C20.2 R48.2 R49.2 RDNP7.2 U2.31(VC9)
NetC16_2: C16.2 D17.2(A) R45.2 U2.30(VC10)
NetC18_2: C18.2 Q14.3(D) R44.1
NetC20_1: C20.1 C26.2 R51.2 R52.2 RDNP7.1 U2.32(VC8)
NetC26_1: C26.1 C30.2 R54.2 R55.2 U2.33(VC7)
NetC30_1: C30.1 C33.2 R57.2 R59.2 U2.34(VC6)
NetC34_2: C34.2 R61.2 R62.2 U2.35(VC5B)
NetC35_1: C35.1 C36.2 R66.2 R67.2 RDNP8.2 U2.37(VC4)
NetC35_2: C35.2 D23.2(A) R64.2 U2.36(VC5)
NetC36_1: C36.1 C37.2 R69.2 R70.2 RDNP8.1 U2.38(VC3)
NetC37_1: C37.1 C38.2 R72.2 R73.2 U2.39(VC2)
NetC38_1: C38.1 C39.2 R75.2 R76.2 U2.40(VC1)
NetC39_1: C39.1 C40.2 R78.2 R79.2 U2.41(VC0)
NetD9_1: D9.1(K) Q8.1(G) R24.1
NetD10_2: D10.2(A) D12.1(K) R26.1 RDNP5.2
NetD11_1: D11.1(K) Q9.1(G) R29.1
NetD13_1: D13.1(K) Q10.1(G) R32.1
NetD14_1: D14.1(K) Q12.1(G) R36.1
NetD15_1: D15.1(K) Q13.1(G) R39.1
NetD16_1: D16.1(K) R41.1 R44.2
NetD18_1: D18.1(K) Q15.1(G) R48.1
NetD19_1: D19.1(K) Q16.1(G) R51.1
NetD20_1: D20.1(K) Q17.1(G) R54.1
NetD21_1: D21.1(K) Q19.1(G) R57.1
NetD22_1: D22.1(K) Q20.1(G) R61.1
NetD24_1: D24.1(K) Q21.1(G) R66.1
NetD25_1: D25.1(K) Q22.1(G) R69.1
NetD26_1: D26.1(K) Q23.1(G) R72.1
NetD27_1: D27.1(K) Q24.1(G) R75.1
NetD28_1: D28.1(K) Q25.1(G) R78.1
NetDDNP1_1: DDNP1.1(K) RDNP5.1 RDNP6.2
NetQ6_3: Q6.3(D) Q7.3(D) R21.2
NetQ7_1: Q7.1(G) Q11.3(D) R21.1 R27.2
NetQ7_2: Q7.2(S) R26.2
NetQ8_3: Q8.3(D) R23.1
NetQ9_3: Q9.3(D) R28.1
NetQ10_3: Q10.3(D) R31.1
NetQ11_1: Q11.1(G) R34.1
NetQ12_3: Q12.3(D) R35.1
NetQ13_3: Q13.3(D) R38.1
NetQ14_1: Q14.1(G) R47.2
NetQ15_3: Q15.3(D) R46.1
NetQ16_3: Q16.3(D) R50.1
NetQ17_3: Q17.3(D) R53.1
NetQ18_2: Q18.2(C) Q18.4(C) R42.1
NetQ19_3: Q19.3(D) R56.1
NetQ20_3: Q20.3(D) R60.1
NetQ21_3: Q21.3(D) R65.1
NetQ22_3: Q22.3(D) R68.1
NetQ23_3: Q23.3(D) R71.1
NetQ24_3: Q24.3(D) R74.1
NetQ25_3: Q25.3(D) R77.1

Not connected (* = marked no-connect by the designer): U2 21(NC)* 22(NC)* 23(NC)*

### Notes on the sheet
- Q8, R23 ecualizan las cargas
- R22, R25, C9 forman un filtrado para la celda
- Circuito de BOOT luego de apagar el AFE.
- (near Q14) Q14 FET cascode entre BAT y REGSRC para disipar potencia fuera del encapsulado
- (near NT2) RTx son termistores para ser ubicados en vatias áreas del PACK.
- (near NT2) 3V3 @ 20mA
- BUS de comunicación I2C
- Salidas de FETs DRIVERS capaces de manipular directamente transistores o un circuito externo.
- #IRQ al MCU
- Circuito de filtrado para la medición de corriente que circula.
- (in symbol 103AT-2) t°
- (in symbol ZXTN19100CZTA, Diodes Inc.) 2,4

### Library data of the parts
C8-C14 C16 C20 C22-C28 C30-C43 = Cap 0603: Capacitor
C15 C17 C19 = Cap 1210: Capacitor
C18 C29 = Cap 0805_HV: Capacitor
C21 = Cap 0805: Capacitor
D7 = MMSZ5248BS-7-F: Diode, Zener, 18 V, 200 mW, SOD-323; Manufacturer: Diodes Inc.; SymbolCreator: a0412235; U/M: EA; Power_W: 0.2; Vz_V: 18; Value1: 0.2W; RJA_CperW: 350; AEC Category: Q101; SymbolVersion: 2010-08-25; PartNumber: MMSZ5248BS-7-F; PackageReference: SOD-323; CompType: Zener; Vr_V: N/A; MountType: SMT; RoHS: Y; ComponentLink1Description: Datasheet link; ComponentLink1URL: http://www.diodes.com/datasheets/ds31038.pdf; Published: 2008-10-08; Publisher: Texas Instruments; LatestRevisionDate: 2016-01-12; LatestRevisionNote: Updated Supplier Data; Supplier 1: Digi-Key; Supplier Part Number 1: MMSZ5248BS-FDICT-ND; Supplier 2: Mouser; Supplier Part Number 2: 621-MMSZ5248BS-F; Supplier 3: Farnell; Supplier Part Number 3: 1858632; AEC Qualified: ?
D8 D10 D16 D17 D23 = 1N4148W-7-F: Diode, Ultrafast, 100V, 0.15A, SOD-123; Manufacturer: Diodes Inc.; U/M: EA; Vf_V: 1.25; Io_A: 0.15; Vr_V: 100; Value2: 1.25V; TJmax_C: 150; ComponentLink1URL: http://www.diodes.com/datasheets/ds30086.pdf; SymbolVersion: 2008-12-08; PackageReference: SOD-123; PartNumber: 1N4148W-7-F; ComponentLink1Description: Datasheet link; CompType: Diode; MountType: SMT; RoHS: Y; Value1: 0.15A; Type: Ultrafast; Published: 2008-06-26; Publisher: Texas Instruments; LatestRevisionDate: 2013-10-23; Supplier 1: Digi-Key; Supplier Part Number 1: 1N4148W-FDICT-ND; Supplier 2: Mouser; Supplier Part Number 2: 621-1N4148W-F; Supplier 3: Farnell; Supplier Part Number 3: 1776392
D9 D11 D13-D15 D18-D22 D24-D28 = MMSZ5232BS-7-F: Diode, Zener, 5.6V, 200mW, SOD-323; Manufacturer: Diodes Inc.; U/M: EA; Power_W: 0.2; Vz_V: 5.6; Value1: 0.2W; RJA_CperW: 350; CompType: Zener; SymbolVersion: 2010-08-25; PartNumber: MMSZ5232BS-7-F; PackageReference: SOD-323; Vr_V: N/A; MountType: SMT; RoHS: Y; ComponentLink1Description: Datasheet link; ComponentLink1URL: http://www.diodes.com/datasheets/ds31038.pdf; Published: 2008-10-08; Publisher: Texas Instruments; LatestRevisionDate: 2013-02-11; LatestRevisionNote: Updated Supplier Data; Supplier 1: Digi-Key; Supplier Part Number 1: MMSZ5232BS-FDICT-ND; Supplier 2: Mouser; Supplier Part Number 2: 621-MMSZ5232BS-F
D12 DDNP1 = MMSZ5228BS-7-F: Diode, Zener, 3.9 V, 200 mW, SOD-323; Manufacturer: Diodes Inc.; SymbolCreator: a0412235; U/M: EA; Power_W: 0.2; Vz_V: 3.9; Value1: 0.2W; RJA_CperW: 350; AEC Category: Q101; SymbolVersion: 2010-08-25; PartNumber: MMSZ5228BS-7-F; PackageReference: SOD-323; CompType: Zener; Vr_V: N/A; MountType: SMT; RoHS: Y; ComponentLink1Description: Datasheet link; ComponentLink1URL: http://www.diodes.com/datasheets/ds31038.pdf; Published: 2008-10-08; Publisher: Texas Instruments; LatestRevisionDate: 2016-04-07; LatestRevisionNote: Updated Supplier Data; Supplier 1: Digi-Key; Supplier Part Number 1: MMSZ5228BS-FDICT-ND; Supplier 2: Mouser; Supplier Part Number 2: 621-MMSZ5228BS-F; AEC Qualified: ?
J5 = 395021016: Terminal block, 3.5mm, 16x1, R/A, TH; Manufacturer: Molex; SymbolCreator: a0799628; U/M: EA; SymbolVersion: 2013-12-22; PartNumber: 395021011; PackageReference: 39.90x7.03x9.33 mm; CompType: Terminal Block; RoHS: Y; MountType: TH; ComponentLink1Description: Datasheet Link; ComponentLink1URL: http://www.molex.com/pdm_docs/sd/395021002_sd.pdf; Publisher: Texas Instruments; LatestRevisionDate: 2015-02-18; Supplier 1: Digi-Key; Supplier Part Number 1: WM7779-ND; Supplier 2: Mouser; Supplier Part Number 2: 538-39502-1011
NT2 = Net-Tie: as NT1 on sheet bms_FET_R00; SymbolVersion: 2009-07-01; MountType: SMT; PackageReference: N/A; Publisher: Texas Instruments; LatestRevisionDate: 2015-10-18; LatestRevisionNote: Added Alternate PartNumber and Alternate Manufacturer parameters to appropriate components.
Q6 = ZXMP10A13FTA: as Q1 on sheet bms_FET_R00; SymbolVersion: 2008-07-09; PartNumber: ZXMP10A13FTA; PackageReference: SOT-23; CompType: MOSFET; RoHS: Y; MountType: SMT; Published: 2008-06-19; Publisher: Texas Instruments; LatestRevisionDate: 2013-12-01; LatestRevisionNote: Added parts.; ComponentLink1Description: Datasheet link; ComponentLink1URL: http://www.diodes.com/datasheets/ZXMP10A13F.pdf; Supplier 1: Digi-Key; Supplier Part Number 1: ZXMP10A13FCT-ND; Supplier 2: Mouser; Supplier Part Number 2: 522-ZXMP10A13FTA; Supplier 3: Farnell; Supplier Part Number 3: 1843777
Q7 Q11 = BSS123: MOSFET, N-CH, 100V, 0.17A, SOT-23; Manufacturer: Fairchild Semiconductor; Alternate Manufacturer: None; U/M: EA; ChType: N; VdsMax_V: 100; Value1: 10 ohm; Rdson45_Ohm: 10; Value2: 1.8 nC; QgTyp_nC: 1.8; Vgs_V: 20; IdsMax_A: 0.17; SymbolVersion: 2008-07-28; CompType: MOSFET; PartNumber: BSS123; PackageReference: SOT-23; RoHS: Y; MountType: SMT; Published: 2008-06-19; Publisher: Texas Instruments; LatestRevisionDate: 2013-10-21; LatestRevisionNote: Added parts.; ComponentLink1Description: Datasheet link; ComponentLink1URL: http://www.fairchildsemi.com/ds/BS/BSS123.pdf; Supplier 1: Digi-Key; Supplier Part Number 1: BSS123NCT-ND; Supplier 2: Mouser; Supplier Part Number 2: 512-BSS123; Supplier 3: Farnell; Supplier Part Number 3: 9845321
Q8-Q10 Q12 Q13 Q15-Q17 Q19-Q25 = CSD13381F4: MOSFET, N/P-CH, 12 V, 2.1 A, 1.0x0.35x0.6mm; Manufacturer: Texas Instruments; Alternate Manufacturer: None; SymbolCreator: a0411947; U/M: EA; ChType: N; Value: 12V; VdsMax_V: 12; Value1: 0.14 ohm; Rdson45_ohm: 0.14; Value2: 1.06 nC; QgTyp_nC: 1.06; Vgs_V: 8; IdsMax_A: 2.1; SymbolVersion: 2013-11-21; PartNumber: CSD13381F4; PackageReference: 1.0x0.35x0.6mm; CompType: MOSFET; RoHS: Y; MountType: SMT; Published: 2008-06-19; Publisher: Texas Instruments; LatestRevisionDate: 2015-02-19; LatestRevisionNote: Added parts.; ComponentLink1Description: Datasheet link; ComponentLink1URL: http://www.ti.com/lit/ds/symlink/csd13381f4.pdf; Supplier 1: Digi-Key; Supplier Part Number 1: CSD13381F4-ND; Supplier 2: Mouser; Supplier Part Number 2: 595-CSD13381F4; Supplier 3: Newark; Supplier Part Number 3: 11X3112
Q14 = BST82,215: MOSFET, N-CH, 100 V, 0.19 A, SOT-23; Manufacturer: NXP Semiconductor; Alternate Manufacturer: None; U/M: EA; ChType: N; Value: 100V; VdsMax_V: 100; Value1: 10 ohm; Rdson45_ohm: 10; Value2: ? nC; Vgs_V: 20; IdsMax_A: 0.19; AEC Category: Q101; SymbolVersion: 2008-07-28; CompType: MOSFET; PartNumber: BST82,215; PackageReference: SOT-23; RoHS: Y; MountType: SMT; Published: 2008-06-19; Publisher: Texas Instruments; LatestRevisionDate: 2016-03-03; LatestRevisionNote: Added parts.; ComponentLink1Description: Datasheet link; ComponentLink1URL: http://www.nxp.com/documents/data_sheet/BST82.pdf; Supplier 1: Digi-Key; Supplier Part Number 1: 568-6229-1-ND; Supplier 2: Mouser; Supplier Part Number 2: 771-BST82215; Supplier 3: Newark; Supplier Part Number 3: 75R4704; AEC Qualified: ?
Q18 = ZXTN19100CZTA, Diodes Inc.: Transistor, NPN, 100 V, 5.25 A, SOT-89; SymbolCreator: a0412235; PNP: 0; NPN: 1; Vceo_V: 100; Vcesat1_V: 0.21; Value: 100 V; IcRated_A: 5.25; Value1: 5.25 A; HfeMax: 500; TaMin_C: -55; TaMax_C: 150; CompType: BJT; U/M: EA; AEC Category: Q101; SymbolVersion: 2009-09-01; PartNumber: ZXTN19100CZTA; Manufacturer: Diodes Inc.; PackageReference: SOT-89; RoHS: Y; Value2: 500; Published: 2008-07-31; LatestRevisionDate: 2016-02-25; Publisher: Texas Instruments; ComponentLink1Description: Datasheet link; ComponentLink1URL: http://www.diodes.com/datasheets/ZXTN19100CZ.pdf; Supplier 1: Digi-Key; Supplier Part Number 1: ZXTN19100CZCT-ND; Supplier 2: Mouser; Supplier Part Number 2: 621-ZXTN19100CZTA; MountType: SMT; AEC Qualified: ?
R19-R79 RDNP4-RDNP8 = Res: Resistor
R80 R81 = Res 0805_HV: Resistor
RT1-RT3 = 103AT-2: Thermistor NTC, 10.0k ohm, 1%, Disc, 5x8.4 mm; Manufacturer: SEMITEC Corporation; Tolerance_%: 1; Power_W: 0.01; TaMin_C: -50; TaMax_C: 110; U/M: EA; ComponentLink1URL: http://www.semitec.co.jp/english2/products/pdf/AT_Thermistor.pdf; PackageReference: Disc, 5x8.4 mm; SymbolVersion: 2008-11-25; PartNumber: 103AT-2; ComponentLink1Description: Datasheet link; CompType: ThermistorNTC; Series: AT; MountType: TH; RoHS: Y; Published: 2009-09-22; Publisher: Texas Instruments; LatestRevisionDate: 2013-08-16; Supplier 1: Mouser; Supplier Part Number 1: 954-103AT-2
U2 = BQ7694000DBTR: Battery Monitor for Lithium-Ion and Phosphate Battery Packs, DBT0044A; Manufacturer: Texas Instruments; SymbolCreator: a0412235; CompType: IC; U/M: EA; SymbolVersion: 2012-12-21; PartNumber: BQ7694000DBTR; Alternate PartNumber: BQ7694000DBT; PackageReference: DBT0044A; MountType: SMT; ComponentLink1Description: Datasheet Link; ComponentLink1URL: http://www.ti.com/lit/gpn/bq76920; RoHS: Y; Publisher: Texas Instruments; LatestRevisionDate: 2016-02-12; Alternate Manufacturer: Texas Instruments

## Sheet bms_GAUGE_R00.SchDoc: Gauge
size A4; Author: Tobias Bavasso Piizzi; CompanyName: Introducción al Diseño de Circuitos Impresos; Organization: UTN FRBA; Revision: R00
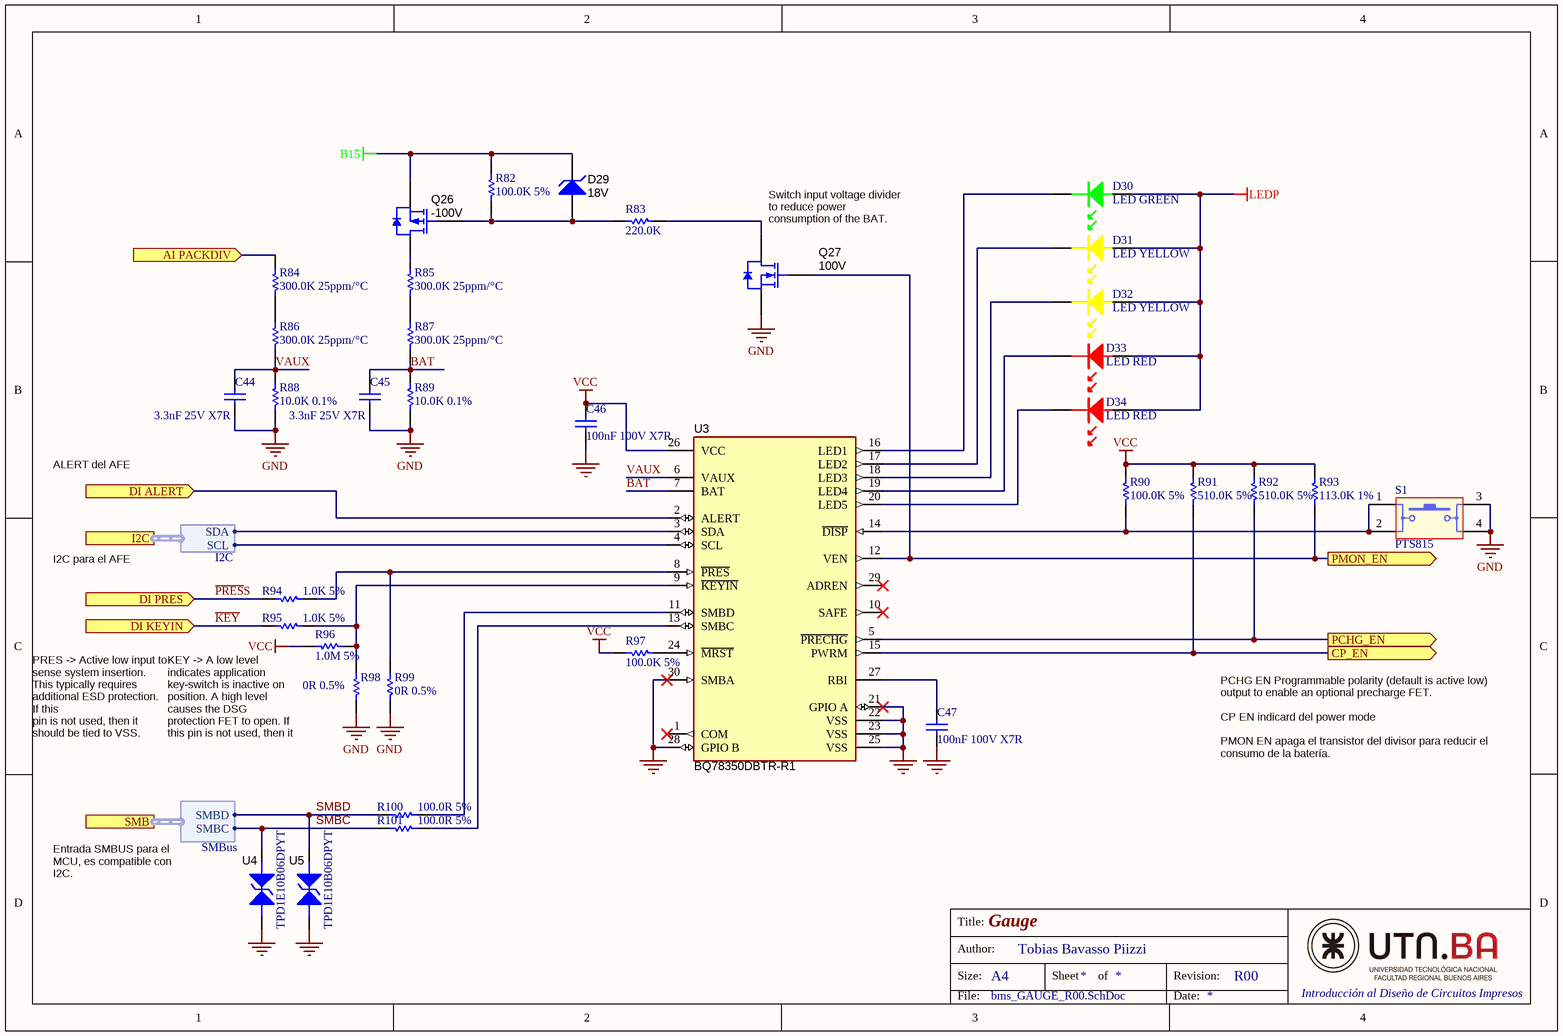
[diagram p6: bms_GAUGE_R00.SchDoc]

### Parts
C44  3.3nF 25V X7R  [C0603]
C45  3.3nF 25V X7R  [C0603]
C46  100nF 100V X7R  [C0603]
C47  100nF 100V X7R  [C0603]
D29  value 18V  [sod-323]  (hidden comment: MMSZ5248BS-7-F)
D30  LED GREEN  [LED0603-G]
D31  LED YELLOW  [LED0603-Y]
D32  LED YELLOW  [LED0603-Y]
D33  LED RED  [LED0603-R]
D34  LED RED  [LED0603-R]
Q26  value -100V  [SOT-23]  (hidden comment: ZXMP10A13FTA)
Q27  value 100V  [SOT-23]  (hidden comment: BSS123)
R82  100.0K 5%  [R0603]
R83  220.0K  [R0603]
R84  300.0K 25ppm/°C  [R0603]
R85  300.0K 25ppm/°C  [R0603]
R86  300.0K 25ppm/°C  [R0603]
R87  300.0K 25ppm/°C  [R0603]
R88  10.0K 0.1%  [R0603]
R89  10.0K 0.1%  [R0603]
R90  100.0K 5%  [R0603]
R91  510.0K 5%  [R0603]
R92  510.0K 5%  [R0603]
R93  113.0K 1%  [R0603]
R94  1.0K 5%  [R0603]
R95  1.0K 5%  [R0603]
R96  1.0M 5%  [R0603]
R97  100.0K 5%  [R0603]
R98  0R 0.5%  [R0603]
R99  0R 0.5%  [R0603]
R100  100.0R 5%  [R0603]
R101  100.0R 5%  [R0603]
S1  PTS815  [PTS815SJK250SMTRLFS]
U3  BQ78350DBTR-R1  [DBT0030A_N]
U4  TPD1E10B06DPYT  [DPY0002A]
U5  TPD1E10B06DPYT  [DPY0002A]

### Ports
AI PACKDIV (in), CP_EN (out), DI ALERT (in), DI KEYIN (in), DI PRES (in), I2C (harness I2C), PCHG_EN (out), PMON_EN (out), SMB (harness SMBus)

### Harnesses
I2C: SDA, SCL
SMBus: SMBD, SMBC

### Nets
B15: D29.1(K) Q26.2(S) R82.1
GND: C44.1 C45.1 C46.1 C47.1 Q27.2(S) R88.2 R89.2 R98.2 R99.2 S1.3 S1.4 U3.21(GPIO_A) U3.22(VSS) U3.23(VSS) U3.25(VSS) U3.28(GPIO_B) U3.30(SMBA) U4.1(IO_LINE) U5.1(IO_LINE)
LEDP: D30.2(A) D31.2(A) D32.2(A) D33.2(A) D34.2(A)
VCC: C46.2 R90.2 R91.1 R92.1 R93.1 R96.1 R97.2 U3.26(VCC)
~{KEY}: R95.2 ; port DI KEYIN
~{PRES}S: R94.2 ; port DI PRES
ALERT: U3.2(ALERT) ; port DI ALERT
BAT: C45.2 R87.2 R89.1 U3.7(BAT)
CP_EN: R91.2 U3.15(PWRM) ; port CP_EN
PACKDIV: R84.1 ; port AI PACKDIV
PCHG_EN: R92.2 U3.5(~{PRECHG}) ; port PCHG_EN
PMON_EN: Q27.1(G) R93.2 U3.12(VEN) ; port PMON_EN
SCL: U3.4(SCL) ; port I2C.SCL
SDA: U3.3(SDA) ; port I2C.SDA
SMBC: R101.2 U4.2(GND) ; port SMB.SMBC
SMBD: R100.2 U5.2(GND) ; port SMB.SMBD
VAUX: C44.2 R86.2 R88.1 U3.6(VAUX)
NetC47_2: C47.2 U3.27(RBI)
NetD29_2: D29.2(A) Q26.1(G) R82.2 R83.2
NetD30_1: D30.1(K) U3.16(LED1)
NetD31_1: D31.1(K) U3.17(LED2)
NetD32_1: D32.1(K) U3.18(LED3)
NetD33_1: D33.1(K) U3.19(LED4)
NetD34_1: D34.1(K) U3.20(LED5)
NetQ26_3: Q26.3(D) R85.1
NetQ27_3: Q27.3(D) R83.1
NetR84_2: R84.2 R86.1
NetR85_2: R85.2 R87.1
NetR90_1: R90.1 S1.1 S1.2 U3.14(~{DISP})
NetR94_1: R94.1 R99.1 U3.8(~{PRES})
NetR95_1: R95.1 R96.2 R98.1 U3.9(~{KEYIN})
NetR97_1: R97.1 U3.24(~{MRST})
NetR100_1: R100.1 U3.11(SMBD)
NetR101_1: R101.1 U3.13(SMBC)

Not connected (* = marked no-connect by the designer): U3 1(COM)* 10(SAFE)* 29(ADREN)*

### Notes on the sheet
- (near Q27) Switch input voltage divider to reduce power consumption of the BAT.
- ALERT del AFE
- I2C para el AFE
- PRES -> Active low input to sense system insertion. This typically requires additional ESD protection. If this
  pin is not used, then it should be tied to VSS.
- (near R96) KEY -> A low level indicates application key-switch is inactive on position. A high level causes the DSG
  protection FET to open. If this pin is not used, then it should be tied to VSS.
- PCHG EN Programmable polarity (default is active low) output to enable an optional precharge FET.
  CP EN indicard del power mode
  PMON EN apaga el transistor del divisor para reducir el consumo de la batería.
- Entrada SMBUS para el MCU, es compatible con I2C.
- Title:
- Size:
- Author:
- A4
- Sheet
- of
- Revision:
- File:
- Date:

### Library data of the parts
C44-C47 = Cap 0603: Capacitor
D29 = MMSZ5248BS-7-F: as D7 on sheet bms_AFE_R00; SymbolVersion: 2010-08-25; PartNumber: MMSZ5248BS-7-F; PackageReference: SOD-323; CompType: Zener; Vr_V: N/A; MountType: SMT; RoHS: Y; ComponentLink1Description: Datasheet link; ComponentLink1URL: http://www.diodes.com/datasheets/ds31038.pdf; Published: 2008-10-08; Publisher: Texas Instruments; LatestRevisionDate: 2016-01-12; LatestRevisionNote: Updated Supplier Data; Supplier 1: Digi-Key; Supplier Part Number 1: MMSZ5248BS-FDICT-ND; Supplier 2: Mouser; Supplier Part Number 2: 621-MMSZ5248BS-F; Supplier 3: Farnell; Supplier Part Number 3: 1858632; AEC Qualified: ?
D30 = LED GREEN: LED G
D31 D32 = LED YELLOW: LED Y
D33 D34 = LED RED: LED R
Q26 = ZXMP10A13FTA: as Q1 on sheet bms_FET_R00; SymbolVersion: 2008-07-09; PartNumber: ZXMP10A13FTA; PackageReference: SOT-23; CompType: MOSFET; RoHS: Y; MountType: SMT; Published: 2008-06-19; Publisher: Texas Instruments; LatestRevisionDate: 2013-12-01; LatestRevisionNote: Added parts.; ComponentLink1Description: Datasheet link; ComponentLink1URL: http://www.diodes.com/datasheets/ZXMP10A13F.pdf; Supplier 1: Digi-Key; Supplier Part Number 1: ZXMP10A13FCT-ND; Supplier 2: Mouser; Supplier Part Number 2: 522-ZXMP10A13FTA; Supplier 3: Farnell; Supplier Part Number 3: 1843777
Q27 = BSS123: as Q7 on sheet bms_AFE_R00; SymbolVersion: 2008-07-28; CompType: MOSFET; PartNumber: BSS123; PackageReference: SOT-23; RoHS: Y; MountType: SMT; Published: 2008-06-19; Publisher: Texas Instruments; LatestRevisionDate: 2013-10-21; LatestRevisionNote: Added parts.; ComponentLink1Description: Datasheet link; ComponentLink1URL: http://www.fairchildsemi.com/ds/BS/BSS123.pdf; Supplier 1: Digi-Key; Supplier Part Number 1: BSS123NCT-ND; Supplier 2: Mouser; Supplier Part Number 2: 512-BSS123; Supplier 3: Farnell; Supplier Part Number 3: 9845321
R82-R101 = Res: Resistor
S1 = PTS815: SWITCH TACTILE SPST-NO 0.05A 12V
U3 = BQ78350DBTR-R1: CEDV Li-Ion Gas Gauge and Battery Management Controller Companion to the bq769x0 Battery Monitoring AFE, DBT0030A; Alternate PartNumber: BQ78350DBT-R1; Manufacturer: Texas Instruments; SymbolCreator: x0208325; CompType: IC; U/M: EA; SymbolVersion: 2013-11-18; PartNumber: BQ78350DBTR-R1; PackageReference: DBT0030A; MountType: SMT; ComponentLink1Description: Datasheet Link; ComponentLink1URL: http://www.ti.com/lit/ds/symlink/bq78350-r1.pdf; RoHS: Y; Publisher: Texas Instruments; LatestRevisionDate: 2016-04-08; Alternate Manufacturer: Texas Instruments
U4 U5 = TPD1E10B06DPYT: ESD Protection in 0402 Package with 10 pF Capacitance and 6 V Breakdown, 1 Channel, -40 to +125 degC, 2-pin X2SON (DPY); Manufacturer: Texas Instruments; Alternate PartNumber: Equivalent; Breakdown Voltage(Min)(V): 6; Eco-Plan: TBD; IEC 61000-4-2 Air-Gap(+/- kV): 30; IO Capacitance(Typ)(pF): 10; SubFamily: ESD Solution; DatasheetVersion: SLLSEB1; PackageVersion: revA, Apr-2010; PackageReference: DPY0002A; PackageDescription: 2-Pin Plastic Small Outline No-Lead 1.0 x 0.6 x 0.4 mm Body; Supplier 1: Mouser; Supplier Part Number 1: N/A; IEC 61000-4-2 Contact(+/- kV): 30; IO Leakage Current(nA): 10; MountType: SMT; PartNumber: TPD1E10B06DPYT; ComponentLink1Description: Datasheet; ComponentLink1URL: http://www.ti.com/general/docs/lit/getliterature.tsp?genericPartNumber=TPD1E10B06&fileType=pdf; ComponentLink2Description: URL Link1; ComponentLink2URL: SamplesURL:http://www.ti.com/product/tpd1e10b06#samples; Alternate Manufacturer: Texas Instruments

## Sheet bms_EMBEDDED_R00.SchDoc: Sistema Embebido
size A4; Author: Tobias Bavasso Piizzi; CompanyName: Introducción al Diseño de Circuitos Impresos; Organization: UTN FRBA; Revision: R00
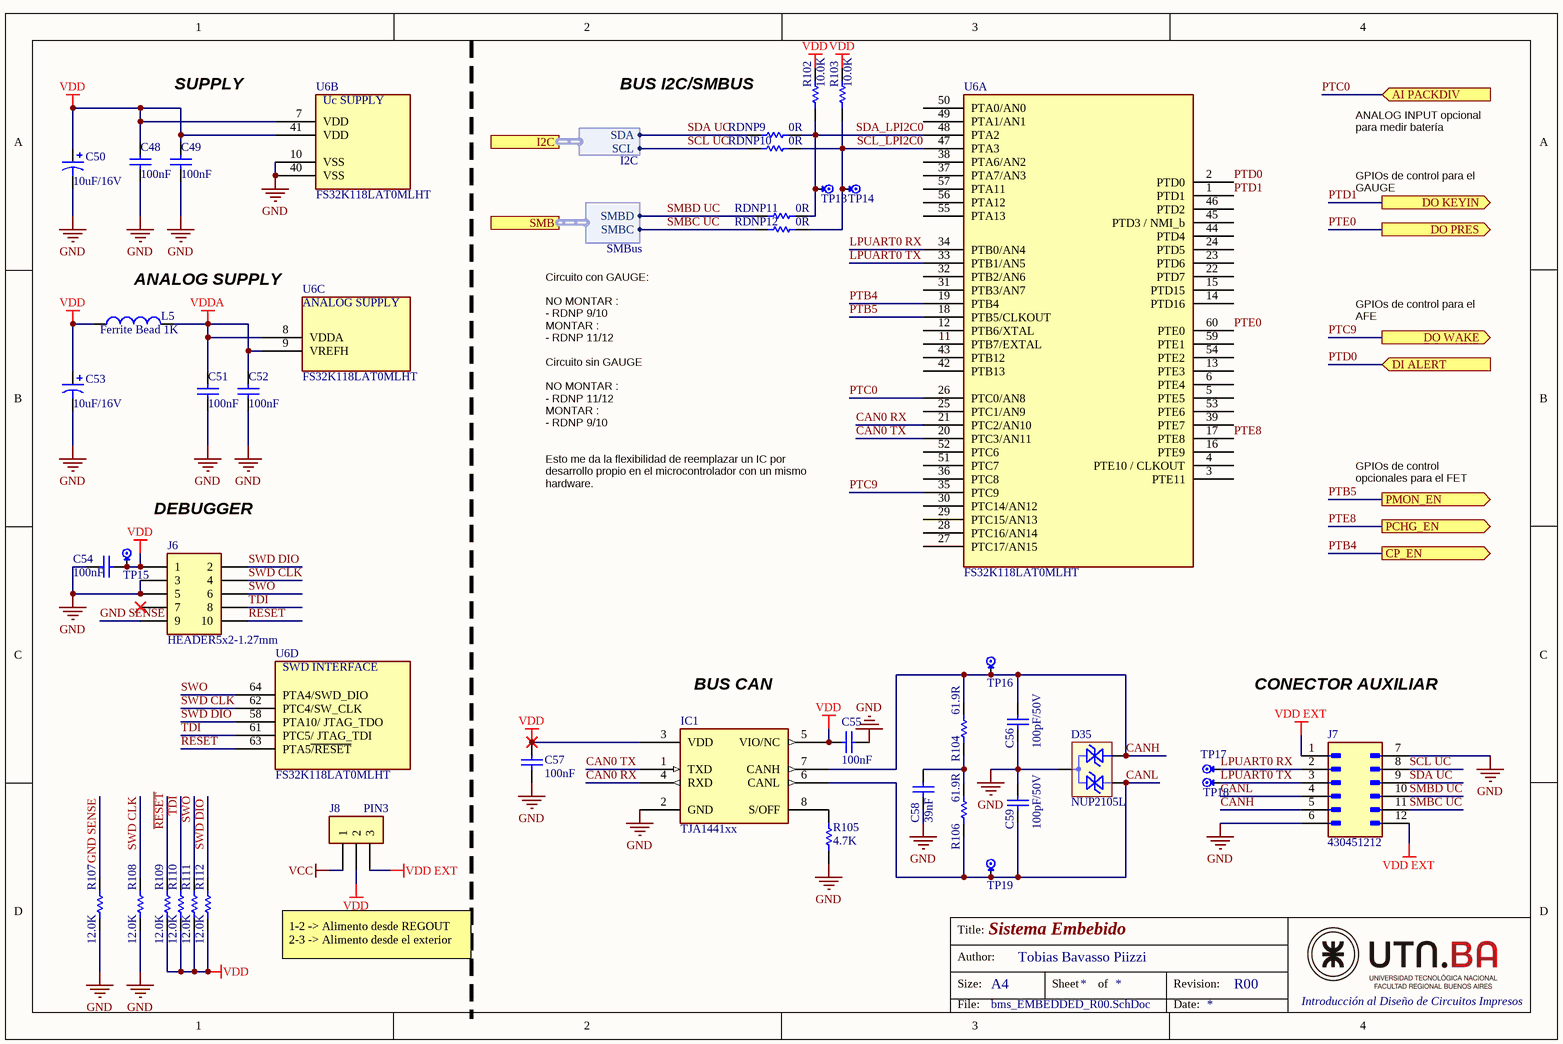
[diagram p7: bms_EMBEDDED_R00.SchDoc]

### Parts
C48  100nF  [C0603]
C49  100nF  [C0603]
C50  10uF/16V  [1206 Cap Tant]
C51  100nF  [C0603]
C52  100nF  [C0603]
C53  10uF/16V  [1206 Cap Tant]
C54  100nF  [C0603]
C55  100nF  [C0603]
C56  100pF/50V  [C0603]
C57  100nF  [C0603]
C58  39nF  [C0603]
C59  100pF/50V  [C0603]
D35  NUP2105L  [SOT-23]
IC1  TJA1441xx  [SOIC8]
J6  HEADER5x2-1.27mm  [PAD10-2X05-HH]
J7  430451212  [MOLEX_430451212]
J8  PIN3  [SIP3]
L5  Ferrite Bead 1K  [0603 FB]
R102  10.0K  [R0603]
R103  10.0K  [R0603]
R104  61.9R  [R0603]
R105  4.7K  [R0603]
R106  61.9R  [R0603]
R107  12.0K  [R0603]
R108  12.0K  [R0603]
R109  12.0K  [R0603]
R110  12.0K  [R0603]
R111  12.0K  [R0603]
R112  12.0K  [R0603]
RDNP9  0R  [R0603]
RDNP10  0R  [R0603]
RDNP11  0R  [R0603]
RDNP12  0R  [R0603]
TP13  Test Point  [TEST POINT SMD 1]  (value not drawn)
TP14  Test Point  [TEST POINT SMD 1]  (value not drawn)
TP15  Test Point  [TEST POINT SMD 1]  (value not drawn)
TP16  Test Point  [TEST POINT SMD 1]  (value not drawn)
TP17  Test Point  [TEST POINT SMD 1]  (value not drawn)
TP18  Test Point  [TEST POINT SMD 1]  (value not drawn)
TP19  Test Point  [TEST POINT SMD 1]  (value not drawn)
U6  FS32K118LAT0MLHT  [LQFP64-NXP]  (parts A,B,C,D of 4)

### Ports
AI PACKDIV (in), CP_EN (out), DI ALERT (in), DO KEYIN (out), DO PRES (out), DO WAKE (out), I2C (harness I2C), PCHG_EN (out), PMON_EN (out), SMB (harness SMBus)

### Harnesses
I2C: SDA, SCL
SMBus: SMBD, SMBC

### Nets
GND: C48.1 C49.1 C50.2 C51.1 C52.1 C53.2 C54.1 C55.1 C56.1 C57.2 C58.1 C59.2 D35.3 IC1.2(GND) J6.3 J6.5 J7.6 J7.7 R105.1 R107.2 R108.2 U6.10(VSS) U6.40(VSS)
VCC: J8.1
VDD: C48.2 C49.2 C50.1 C53.1 C54.2 C55.2 C57.1 IC1.3(VDD) IC1.5(VIO/NC) J6.1 J8.2 L5.1 R102.1 R103.1 R109.2 R110.2 R111.2 R112.2 TP15.1 U6.7(VDD) U6.41(VDD)
VDD EXT: J7.1 J7.12 J8.3
VDDA: C51.2 C52.2 L5.2 U6.8(VDDA) U6.9(VREFH)
~{RESET}: J6.10 R109.1 U6.63(PTA5~{/RESET})
CAN0 RX: IC1.4(RXD) U6.21(PTC2/AN10)
CAN0 TX: IC1.1(TXD) U6.20(PTC3/AN11)
CANH: C56.2 D35.1 IC1.7(CANH) J7.5 R104.2 TP16.1
CANL: C59.1 D35.2 IC1.6(CANL) J7.4 R106.1 TP19.1
GND SENSE: J6.9 R107.1
LPUART0 RX: J7.2 TP17.1 U6.34(PTB0/AN4)
LPUART0 TX: J7.3 TP18.1 U6.33(PTB1/AN5)
PTB4: U6.19(PTB4) ; port CP_EN
PTB5: U6.18(PTB5/CLKOUT) ; port PMON_EN
PTC0: U6.26(PTC0/AN8) ; port AI PACKDIV  [project net PACKDIV]
PTC9: U6.35(PTC9) ; port DO WAKE
PTD0: U6.2(PTD0) ; port DI ALERT  [project net ALERT]
PTD1: U6.1(PTD1) ; port DO KEYIN  [project net ~{KEY}]
PTE0: U6.60(PTE0) ; port DO PRES  [project net ~{PRES}S]
PTE8: U6.17(PTE8) ; port PCHG_EN
SCL UC: J7.8 RDNP10.1 ; port I2C.SCL  [project net SCL]
SCL_LPI2C0: R103.2 RDNP10.2 RDNP12.2 TP14.1 U6.47(PTA3)
SDA UC: J7.9 RDNP9.1 ; port I2C.SDA  [project net SDA]
SDA_LPI2C0: R102.2 RDNP9.2 RDNP11.2 TP13.1 U6.48(PTA2)
SMBC UC: J7.11 RDNP12.1 ; port SMB.SMBC  [project net SMBC]
SMBD UC: J7.10 RDNP11.1 ; port SMB.SMBD  [project net SMBD]
SWD CLK: J6.4 R108.1 U6.62(PTC4/SW_CLK)
SWD DIO: J6.2 R112.1 U6.58(PTA10/_JTAG_TDO)
SWO: J6.6 R111.1 U6.64(PTA4/SWD_DIO)
TDI: J6.8 R110.1 U6.61(PTC5/_JTAG_TDI)
NetC58_2: C58.2 R104.1 R106.2
NetIC1_8: IC1.8(S/OFF) R105.2

Not connected (* = marked no-connect by the designer): J6 7*; U6 3(PTE11) 4(PTE10_/_CLKOUT) 5(PTE5) 6(PTE4) 11(PTB7/EXTAL) 12(PTB6/XTAL) 13(PTE3) 14(PTD16) 15(PTD15) 16(PTE9) 22(PTD7) 23(PTD6) 24(PTD5) 25(PTC1/AN9) 27(PTC17/AN15) 28(PTC16/AN14) 29(PTC15/AN13) 30(PTC14/AN12) 31(PTB3/AN7) 32(PTB2/AN6) 36(PTC8) 37(PTA7/AN3) 38(PTA6/AN2) 39(PTE7) 42(PTB13) 43(PTB12) 44(PTD4) 45(PTD3_/_NMI_b) 46(PTD2) 49(PTA1/AN1) 50(PTA0/AN0) 51(PTC7) 52(PTC6) 53(PTE6) 54(PTE2) 55(PTA13) 56(PTA12) 57(PTA11) 59(PTE1)

### Notes on the sheet
- SUPPLY
- BUS I2C/SMBUS
- ANALOG INPUT opcional para medir batería
- GPIOs de control para el GAUGE
- (near L5) ANALOG SUPPLY
- GPIOs de control para el AFE
- DEBUGGER
- Circuito con GAUGE:
  NO MONTAR :
  - RDNP 9/10
  MONTAR :
  - RDNP 11/12
  Circuito sin GAUGE
  NO MONTAR :
  - RDNP 11/12
  MONTAR :
  - RDNP 9/10
  Esto me da la flexibilidad de reemplazar un IC por desarrollo propio en el microcontrolador con un mismo hardware.
- GPIOs de control opcionales para el FET
- (near IC1) BUS CAN
- CONECTOR AUXILIAR
- 1-2 -> Alimento desde REGOUT
  2-3 -> Alimento desde el exterior
- Title:
- Size:
- Author:
- A4
- Sheet
- of
- Revision:
- File:
- Date:
- (in symbol FS32K118LAT0MLHT, part B) Uc SUPPLY
- (in symbol FS32K118LAT0MLHT, part C) ANALOG SUPPLY
- (in symbol FS32K118LAT0MLHT, part D) SWD INTERFACE

### Library data of the parts
C48 C49 C51 C52 C54-C59 = Cap 0603: Capacitor
C50 C53 = Cap Pol Tantalio: Polarized Capacitor Tantalium
D35 = NUP2105L: Dual Line CAN Bus Protector TVS DIODE 24VWM 44VC SOT23-3
IC1 = TJA1441xx: High-speed CAN transceiver
J6 = HEADER5x2-1.27mm: PAD10-2X05-HH
J7 = 430451212: Micro-Fit 3.0 43045 / CONN HEADER VERT 12POS 3MM; MP: 430451012; Price: None; Availability: Unavailable; Value: *; Package: None
L5 = BLM18KG102SN1D: BLM18KG102SN1D 1K
R102-R112 RDNP9-RDNP12 = Res: Resistor
U6 = FS32K118LAT0MLHT: ARM® Cortex®-M0+ series Microcontroller IC 32-Bit Single-Core 48MHz 256KB (256K x 8) FLASH 64-LQFP (10x10)

## Nets that join several sheets
B0: bms_FET_R00 (R1.2), bms_AFE_R00 (D28.2 J5.16 Q25.2 R79.1)
B15: bms_FET_R00 (R4.2), bms_AFE_R00 (8 pins), bms_GAUGE_R00 (D29.1 Q26.2 R82.1)
GND: bms_FET_R00 (5 pins), bms_AFE_R00 (18 pins), bms_GAUGE_R00 (19 pins), bms_EMBEDDED_R00 (23 pins)
LEDP: bms_AFE_R00 (C32.2 Q18.3), bms_GAUGE_R00 (5 pins)
PACK+: bms_FET_R00 (11 pins), bms_AFE_R00 (D7.1 Q6.2 R19.2)
PACK-: bms_FET_R00 (7 pins), bms_AFE_R00 (R80.1)
VCC: bms_AFE_R00 (NT2.2), bms_GAUGE_R00 (8 pins), bms_EMBEDDED_R00 (J8.1)
~{KEY}: bms_GAUGE_R00 (R95.2), bms_EMBEDDED_R00 (U6.1)
~{PRES}S: bms_GAUGE_R00 (R94.2), bms_EMBEDDED_R00 (U6.60)
ALERT: bms_AFE_R00 (C31.2 R58.2 TP12.1 U2.44), bms_GAUGE_R00 (U3.2), bms_EMBEDDED_R00 (U6.2)
BATT-: bms_FET_R00 (7 pins), bms_AFE_R00 (R81.1)
CHG_EN: bms_FET_R00 (TP3.1 U1.4), bms_AFE_R00 (U2.2)
CP_EN: bms_BLOCKS_R00 (RDNP3.2), bms_FET_R00 (TP4.1 U1.5), bms_GAUGE_R00 (R91.2 U3.15)
DSG_EN: bms_FET_R00 (TP6.1 U1.6), bms_AFE_R00 (U2.1)
PACKDIV: bms_FET_R00 (U1.10), bms_GAUGE_R00 (R84.1), bms_EMBEDDED_R00 (U6.26)
PCHG_EN: bms_BLOCKS_R00 (RDNP1.2), bms_FET_R00 (TP8.1 U1.8), bms_GAUGE_R00 (R92.2 U3.5)
PMON_EN: bms_BLOCKS_R00 (RDNP2.2), bms_FET_R00 (TP7.1 U1.7), bms_GAUGE_R00 (Q27.1 R93.2 U3.12)
PTB4: bms_BLOCKS_R00 (RDNP3.1), bms_EMBEDDED_R00 (U6.19)
PTB5: bms_BLOCKS_R00 (RDNP2.1), bms_EMBEDDED_R00 (U6.18)
PTC9: bms_AFE_R00 (RDNP6.1), bms_EMBEDDED_R00 (U6.35)
PTE8: bms_BLOCKS_R00 (RDNP1.1), bms_EMBEDDED_R00 (U6.17)
SCL: bms_AFE_R00 (U2.5), bms_GAUGE_R00 (U3.4), bms_EMBEDDED_R00 (J7.8 RDNP10.1)
SDA: bms_AFE_R00 (U2.4), bms_GAUGE_R00 (U3.3), bms_EMBEDDED_R00 (J7.9 RDNP9.1)
SMBC: bms_GAUGE_R00 (R101.2 U4.2), bms_EMBEDDED_R00 (J7.11 RDNP12.1)
SMBD: bms_GAUGE_R00 (R100.2 U5.2), bms_EMBEDDED_R00 (J7.10 RDNP11.1)